# Altium project US-Plus-CPM.PrjPcb (part 1 of 2)
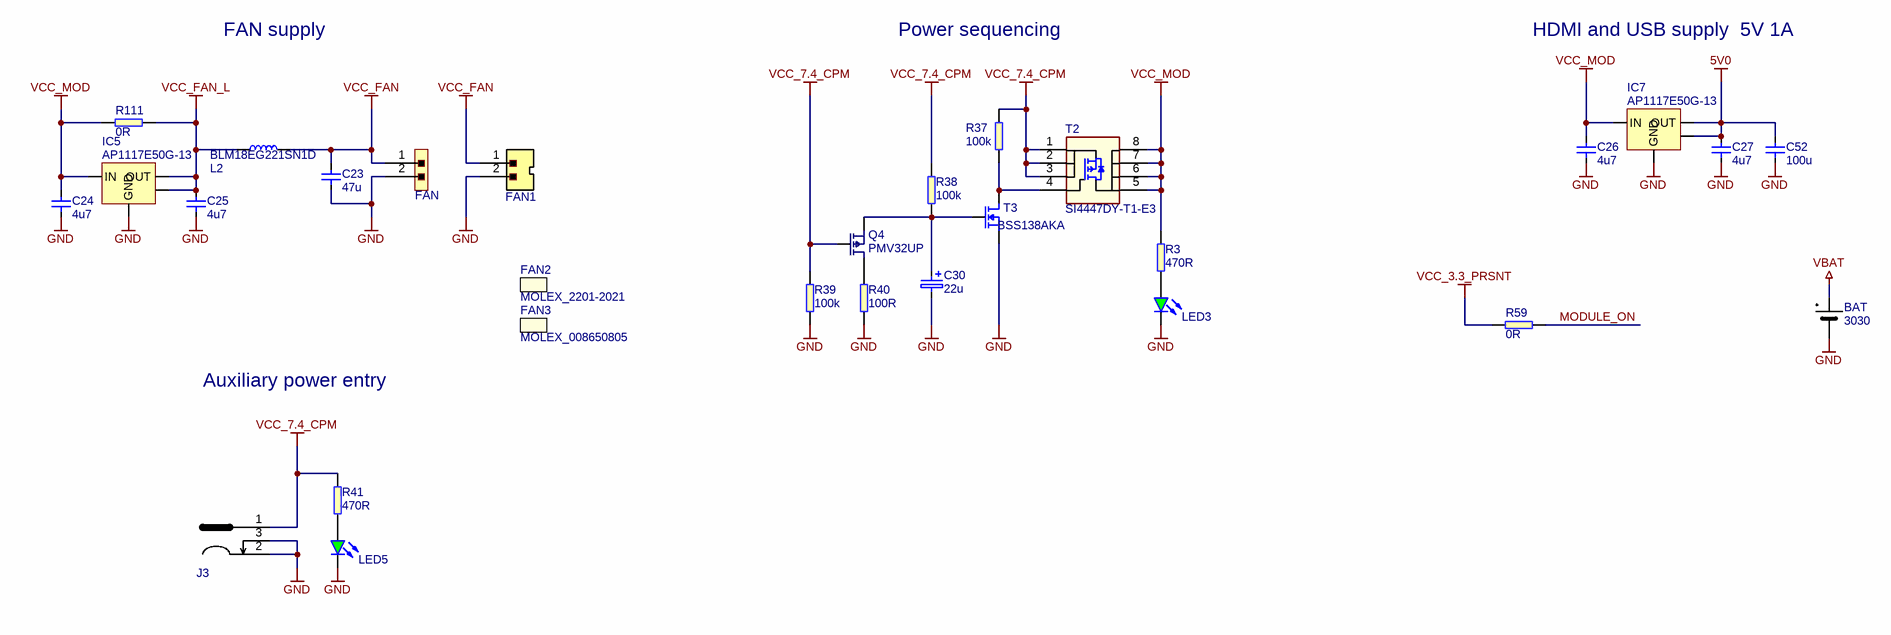
[diagram p0: Supplies.SchDoc]
AM_Title: Ultrascale Plus CPM; AM_Status: OSHW; AM_Revision: 3.3.1
9 sheets, 279 parts. Net scope: global (net labels, ports and power ports of the same name join across sheets).
Board file: PCB.PcbDoc
Sheets:
  Supplies.SchDoc
  SoM-Connectors.SchDoc
  Backplane-Connector.SchDoc
  SoM-MGTH.SchDoc
  Sensor-Connector.SchDoc
  Display-Port.SchDoc
  Debug.SchDoc
  Interfaces.SchDoc
  HDMI.SchDoc

## Sheet Supplies.SchDoc
size A3; DocumentNumber: 1; SheetNumber: 1; SheetTotal: 9; PageSetup: Record=PageOptions|CenterHorizontal=True|CenterVertical=True|PrintScale=0.97|XCorrection=1.00|YCorrection=1.00|PrintKind=1|BorderSize=5000000|LeftOffset=0|BottomOffset=0|Orientation=2|PaperLength=2970|PaperWidth=2100|Scale=100|PaperSource=7|PrintQuality=600|MediaType=1|DitherType=10|PaperKind=A4|PrintScaleMode=1

### Parts
BAT  3030  [KEYSTONE_CR1025]
C23  47u  [1206]
C24  4u7  [0603]
C25  4u7  [0603]
C26  4u7  [0603]
C27  4u7  [0603]
C30  value 22u  [KEMET_C]
C52  100u  [0805]
FAN  *  [HEADER_1X2_male 2.54mm Angle]  (value not drawn)
FAN1  MX-22-23-2021  [molex_2223-2021]  (value not drawn)
FAN2  MOLEX_2201-2021  (no BOM)
FAN3  MOLEX_008650805  (no BOM)
IC5  AP1117E50G-13  [SOT223]
IC7  AP1117E50G-13  [SOT223]
J3  694106106102  [694106106102]  (value not drawn)
L2  BLM18EG221SN1D  [0603]
LED3  KPT-1608SGC  [LED0603]  (value not drawn)
LED5  KPT-1608SGC  [LED0603]  (value not drawn)
Q4  PMV32UP  [SOT-23]
R3  470R  [0603]
R37  100k  [0603]
R38  100k  [0603]
R39  100k  [0603]
R40  100R  [0603]
R41  470R  [0603]
R59  0R  [0603]
R111  0R  [0603]
T2  SI4447DY-T1-E3  [SOIC-SN8_M]
T3  BSS138AKA  [SOT-23]

### Nets
5V0: C27.2 C52.2 IC7.2(OUT) IC7.4(OUT)
GND: BAT.- C23.1 C24.1 C25.1 C26.1 C27.1 C30.2 C52.1 FAN.2 FAN1.2 IC5.1(GND) IC7.1(GND) J3.2 J3.3 LED3.K LED5.K R39.1 R40.1 T3.2(S)
VBAT: BAT.+
VCC_3.3_PRSNT: R59.1
VCC_7.4_CPM: J3.1 Q4.1(G) R37.2 R38.2 R39.2 R41.2 T2.1 T2.2 T2.3
VCC_FAN: C23.2 FAN.1 FAN1.1 L2.2
VCC_FAN_L: C25.2 IC5.2(OUT) IC5.4(OUT) L2.1 R111.2
VCC_MOD: C24.2 C26.2 IC5.3(IN) IC7.3(IN) R3.2 R111.1 T2.5 T2.6 T2.7 T2.8
MODULE_ON: R59.2
NetC30_1: C30.1 Q4.2(S) R38.1 T3.1(G)
NetLED3_A: LED3.A R3.1
NetLED5_A: LED5.A R41.1
NetQ4_3: Q4.3(D) R40.2
NetR37_1: R37.1 T2.4 T3.3(D)

### Notes on the sheet
- FAN supply
- Power sequencing
- HDMI and USB supply  5V 1A
- Auxiliary power entry
- Title:
- Size:
- Date:
- A3
- Revision:
- Page:
- of
- Antmicro Ltd.
- File:
- www.antmicro.com

### Library data of the parts
BAT = Keystone_CR1025: SMT holder for  CR1025 battery; Value: 3030; Manufacturer: Keystone; Part Number: Keystone_CR1025; MPN: 3030
C23 = C_47u_1206: MLCC SMT Capacitor 47uF 1206; Manufacturer: MURATA; MPN: GRM31CC80J476KE18L; Value: 47u; Part Number: C_47u_1206
C24-C27 = C_4u7_0603: MLCC SMT Capacitor 4u7F 0603; Manufacturer: MULTICOMP; MPN: MC0603X475K6R3CT; Value: 4u7; Part Number: C_4u7_0603
C30 = C_22u_KEMET_C: Tantalum SMT Capacitor 22uF Case KEMET_C; Manufacturer: KEMET; MPN: T491C226K025AT; Part Number: C_22u_KEMET_C
C52 = C_100u_0805: MLCC SMT Capacitor 100uF 0805; Manufacturer: MURATA; MPN: GRM21BR60J107ME15L; Part Number: C_100u_0805; Value: 100u
FAN = HEADER_1X2_male_angle: 1x2 pinhead male angle; Part Number: HEADER_1X2_male_angle
FAN1 = molex_2223-2021: Pinhead connector with key; Manufacturer: Molex; MPN: 022232021 A-6373-02A222; Part Number: molex_2223-2021; Value: MX-22-23-2021
FAN2 = MOLEX_2201-2021: KK 254 Crimp Housing 2 circuits; Manufacturer: MOLEX; Part Number: MOLEX_2201-2021; Value: MOLEX_2201-2021; MPN: MOLEX_2201-2021
FAN3 = MOLEX_008650805: conn term female 22-30 awg tin; Manufacturer: MOLEX; Part Number: MOLEX_008650805; Value: MOLEX_008650805; MPN: MOLEX_008650805
IC5 IC7 = AP1117E50G-13: LDO, 2V/5.5V, 1A, 5V,  SOT223; Manufacturer: Diodes; Value: AP1117E50G-13; Part Number: AP1117E50G-13; MPN: AP1117E50G-13
J3 = WE-694106106102: DC Power Jack Right Angled SMT Ø6.4 with 4 soldering pads & pegs WR-DC; Manufacturer: WURTH ELEKTRONIK; Part Number: WE-694106106102; Value: 694106106102; MPN: 694106106102
L2 = BLM18EG221SN1D: MURATA 	BLM18EG221SN1D  FERRITE BEAD, 0.05OHM, 2A, 0603; Part Number: BLM18EG221SN1D; Value: BLM18EG221SN1D; Manufacturer: MURATA; MPN: BLM18EG221SN1D
LED3 LED5 = LED_G: LED Green 0603 case; Part Number: LED_G; Manufacturer: KINGBRIGHT; Value: KPT-1608SGC; MPN: KPT-1608SGC
Q4 = PMV32UP: P CH, 20V, 4A; Manufacturer: NXP; Part Number: PMV32UP; Value: PMV32UP; MPN: PMV32UP
R3 R41 = R_470R_0603: SMT Resistor 470R 0603; Manufacturer: BOURNS; MPN: CR0603-JW-471GLF; Value: 470R; Part Number: R_470R_0603
R37-R39 = R_100k_0603: SMT Resistor 100k 0603; Manufacturer: BOURNS; MPN: CR0603-JW-104GLF; Value: 100k; Part Number: R_100k_0603
R40 = R_100R_0603: SMT Resistor 100R 0603; Manufacturer: MULTICOMP; MPN: MC0063W06035100R; Value: 100R; Part Number: R_100R_0603
R59 R111 = R_0R_0603: SMT Resistor 0R 0603; Manufacturer: BOURNS; MPN: CR0603-J/-000ELF; Value: 0R; Part Number: R_0R_0603
T2 = SI4447DY-T1-E3: p-channel MOSFET, SI4447DY-T1-E3; Manufacturer: VISHAY; Part Number: SI4447DY-T1-E3; Value: SI4447DY-T1-E3; MPN: SI4447DY-T1-E3
T3 = BSS138: MOSFET, N CH, 60V, 0.2A; Part Number: BSS138; Manufacturer: NXP; Value: BSS138AKA; MPN: BSS138AKA

## Sheet SoM-Connectors.SchDoc
size A3; DocumentNumber: 2; SheetNumber: 2; SheetTotal: 9; PageSetup: Record=PageOptions|CenterHorizontal=True|CenterVertical=True|PrintScale=0.97|XCorrection=1.00|YCorrection=1.00|PrintKind=1|BorderSize=5000000|LeftOffset=0|BottomOffset=0|Orientation=2|PaperLength=2970|PaperWidth=2100|Scale=100|PaperSource=7|PrintQuality=600|MediaType=1|DitherType=10|PaperKind=A4|PrintScaleMode=1
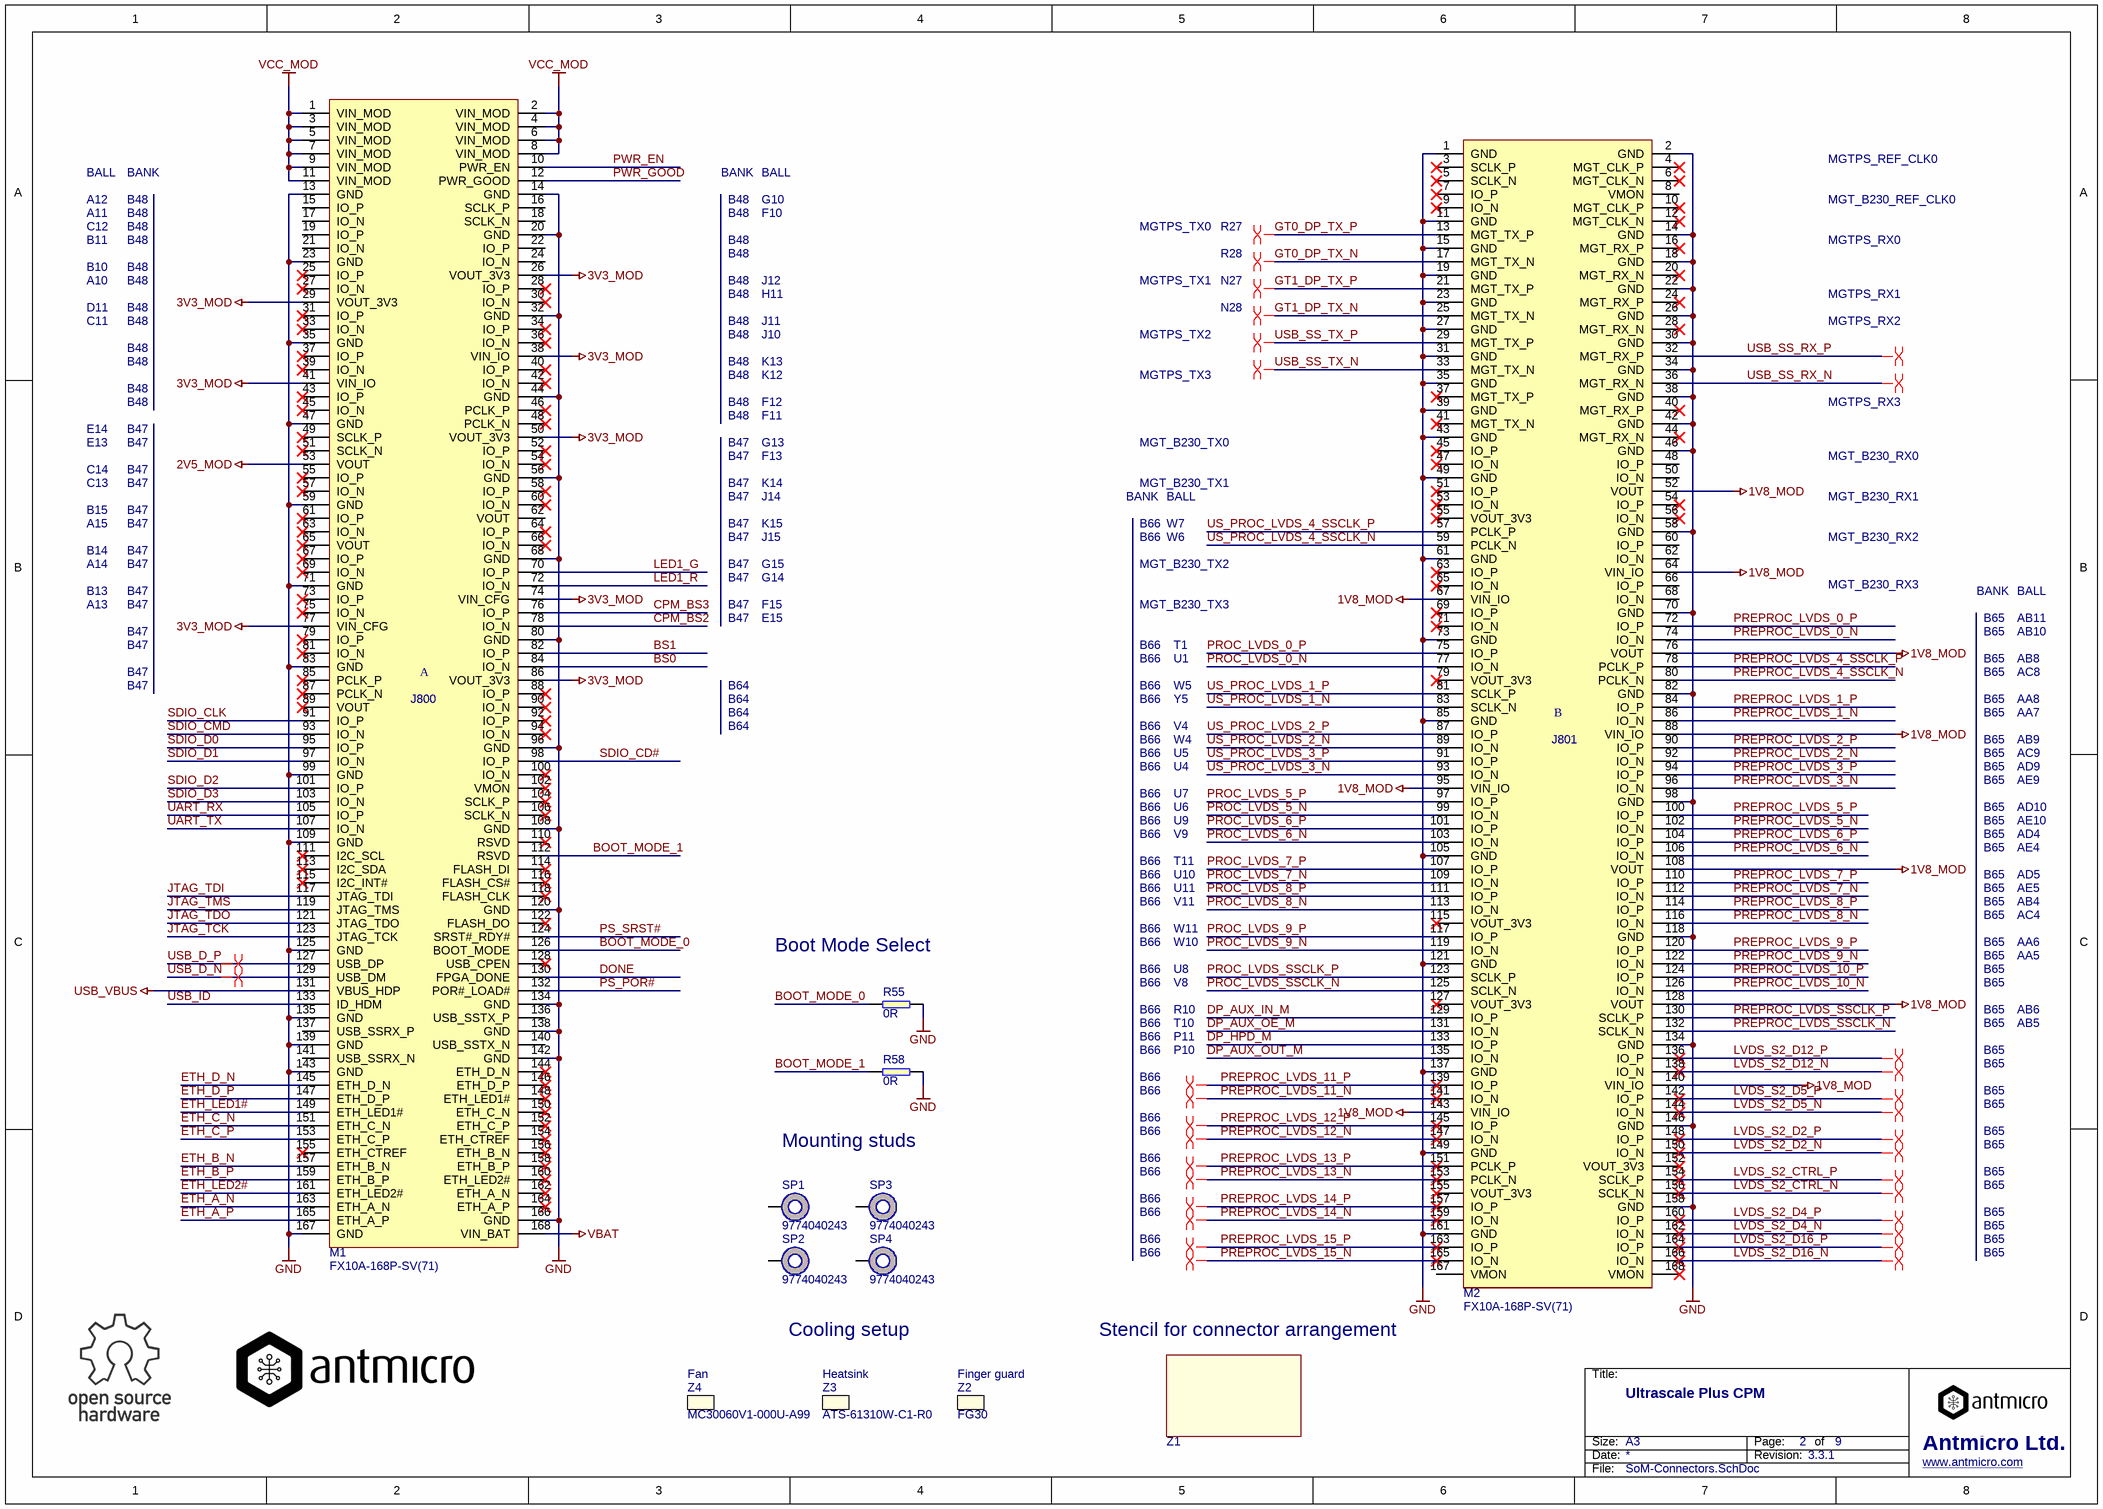
[diagram p1: SoM-Connectors.SchDoc]

### Parts
M1  FX10A-168P-SV(71)  [HIROSE_FX10A-168P-SV(71)]
M2  FX10A-168P-SV(71)  [HIROSE_FX10A-168P-SV(71)]
R55  0R  [0603]
R58  0R  [0603]
SP1  9774040243  [M2-4mm]
SP2  9774040243  [M2-4mm]
SP3  9774040243  [M2-4mm]
SP4  9774040243  [M2-4mm]
Z1  Mechanical  [mercury_74x54_module]  (value not drawn)  (no BOM)
Z2  FG30  (no BOM)
Z3  ATS-61310W-C1-R0  (no BOM)
Z4  MC30060V1-000U-A99  (no BOM)

### Nets
1V8_MOD: M2.52(VOUT) M2.64(VIN_IO) M2.67(VIN_IO) M2.76(VOUT) M2.88(VIN_IO) M2.95(VIN_IO) M2.108(VOUT) M2.128(VOUT) M2.140(VIN_IO) M2.143(VIN_IO)
2V5_MOD: M1.53(VOUT)
3V3_MOD: M1.26(VOUT_3V3) M1.29(VOUT_3V3) M1.38(VIN_IO) M1.41(VIN_IO) M1.50(VOUT_3V3) M1.74(VIN_CFG) M1.77(VIN_CFG) M1.86(VOUT_3V3)
GND: M1.13(GND) M1.14(GND) M1.20(GND) M1.23(GND) M1.32(GND) M1.35(GND) M1.44(GND) M1.47(GND) M1.56(GND) M1.59(GND) M1.68(GND) M1.71(GND) M1.80(GND) M1.83(GND) M1.96(GND) M1.99(GND) M1.108(GND) M1.109(GND) M1.120(GND) M1.125(GND) M1.134(GND) M1.135(GND) M1.138(GND) M1.139(GND) M1.142(GND) M1.143(GND) M1.166(GND) M1.167(GND) M2.1(GND) M2.2(GND) M2.11(GND) M2.14(GND) M2.15(GND) M2.18(GND) M2.19(GND) M2.22(GND) M2.23(GND) M2.26(GND) M2.27(GND) M2.30(GND) M2.31(GND) M2.34(GND) M2.35(GND) M2.38(GND) M2.39(GND) M2.42(GND) M2.43(GND) M2.46(GND) M2.49(GND) M2.58(GND) M2.61(GND) M2.70(GND) M2.73(GND) M2.82(GND) M2.85(GND) M2.98(GND) M2.105(GND) M2.118(GND) M2.121(GND) M2.134(GND) M2.137(GND) M2.146(GND) M2.149(GND) M2.158(GND) M2.161(GND) R55.2 R58.2
USB_VBUS: M1.131(VBUS_HDP)
VBAT: M1.168(VIN_BAT)
VCC_MOD: M1.1(VIN_MOD) M1.2(VIN_MOD) M1.3(VIN_MOD) M1.4(VIN_MOD) M1.5(VIN_MOD) M1.6(VIN_MOD) M1.7(VIN_MOD) M1.8(VIN_MOD) M1.9(VIN_MOD) M1.11(VIN_MOD)
BOOT_MODE_0: M1.126(BOOT_MODE) R55.1
BOOT_MODE_1: M1.112(RSVD) R58.1
BS0: M1.84(IO_N)
BS1: M1.82(IO_P)
CPM_BS2: M1.78(IO_N)
CPM_BS3: M1.76(IO_P)
DONE: M1.130(FPGA_DONE)
DP_AUX_IN_M: M2.129(IO_P)
DP_AUX_OE_M: M2.131(IO_N)
DP_AUX_OUT_M: M2.135(IO_N)
DP_HPD_M: M2.133(IO_P)
ETH_A_N: M1.163(ETH_A_N)
ETH_A_P: M1.165(ETH_A_P)
ETH_B_N: M1.157(ETH_B_N)
ETH_B_P: M1.159(ETH_B_P)
ETH_C_N: M1.151(ETH_C_N)
ETH_C_P: M1.153(ETH_C_P)
ETH_D_N: M1.145(ETH_D_N)
ETH_D_P: M1.147(ETH_D_P)
ETH_LED1#: M1.149(ETH_LED1#)
ETH_LED2#: M1.161(ETH_LED2#)
GT0_DP_TX_N: M2.17(MGT_TX_N)
GT0_DP_TX_P: M2.13(MGT_TX_P)
GT1_DP_TX_N: M2.25(MGT_TX_N)
GT1_DP_TX_P: M2.21(MGT_TX_P)
JTAG_TCK: M1.123(JTAG_TCK)
JTAG_TDI: M1.117(JTAG_TDI)
JTAG_TDO: M1.121(JTAG_TDO)
JTAG_TMS: M1.119(JTAG_TMS)
LED1_G: M1.70(IO_P)
LED1_R: M1.72(IO_N)
LVDS_S2_CTRL_N: M2.156(SCLK_N)
LVDS_S2_CTRL_P: M2.154(SCLK_P)
LVDS_S2_D2_N: M2.150(IO_N)
LVDS_S2_D2_P: M2.148(IO_P)
LVDS_S2_D4_N: M2.162(IO_N)
LVDS_S2_D4_P: M2.160(IO_P)
LVDS_S2_D5_N: M2.144(IO_N)
LVDS_S2_D5_P: M2.142(IO_P)
LVDS_S2_D12_N: M2.138(IO_N)
LVDS_S2_D12_P: M2.136(IO_P)
LVDS_S2_D16_N: M2.166(IO_N)
LVDS_S2_D16_P: M2.164(IO_P)
PREPROC_LVDS_0_N: M2.74(IO_N)
PREPROC_LVDS_0_P: M2.72(IO_P)
PREPROC_LVDS_1_N: M2.86(IO_N)
PREPROC_LVDS_1_P: M2.84(IO_P)
PREPROC_LVDS_2_N: M2.92(IO_N)
PREPROC_LVDS_2_P: M2.90(IO_P)
PREPROC_LVDS_3_N: M2.96(IO_N)
PREPROC_LVDS_3_P: M2.94(IO_P)
PREPROC_LVDS_4_SSCLK_N: M2.80(PCLK_N)
PREPROC_LVDS_4_SSCLK_P: M2.78(PCLK_P)
PREPROC_LVDS_5_N: M2.102(IO_N)
PREPROC_LVDS_5_P: M2.100(IO_P)
PREPROC_LVDS_6_N: M2.106(IO_N)
PREPROC_LVDS_6_P: M2.104(IO_P)
PREPROC_LVDS_7_N: M2.112(IO_N)
PREPROC_LVDS_7_P: M2.110(IO_P)
PREPROC_LVDS_8_N: M2.116(IO_N)
PREPROC_LVDS_8_P: M2.114(IO_P)
PREPROC_LVDS_9_N: M2.122(IO_N)
PREPROC_LVDS_9_P: M2.120(IO_P)
PREPROC_LVDS_10_N: M2.126(IO_N)
PREPROC_LVDS_10_P: M2.124(IO_P)
PREPROC_LVDS_11_N: M2.141(IO_N)
PREPROC_LVDS_11_P: M2.139(IO_P)
PREPROC_LVDS_12_N: M2.147(IO_N)
PREPROC_LVDS_12_P: M2.145(IO_P)
PREPROC_LVDS_13_N: M2.153(PCLK_N)
PREPROC_LVDS_13_P: M2.151(PCLK_P)
PREPROC_LVDS_14_N: M2.159(IO_N)
PREPROC_LVDS_14_P: M2.157(IO_P)
PREPROC_LVDS_15_N: M2.165(IO_N)
PREPROC_LVDS_15_P: M2.163(IO_P)
PREPROC_LVDS_SSCLK_N: M2.132(SCLK_N)
PREPROC_LVDS_SSCLK_P: M2.130(SCLK_P)
PROC_LVDS_0_N: M2.77(IO_N)
PROC_LVDS_0_P: M2.75(IO_P)
PROC_LVDS_5_N: M2.99(IO_N)
PROC_LVDS_5_P: M2.97(IO_P)
PROC_LVDS_6_N: M2.103(IO_N)
PROC_LVDS_6_P: M2.101(IO_P)
PROC_LVDS_7_N: M2.109(IO_N)
PROC_LVDS_7_P: M2.107(IO_P)
PROC_LVDS_8_N: M2.113(IO_N)
PROC_LVDS_8_P: M2.111(IO_P)
PROC_LVDS_9_N: M2.119(IO_N)
PROC_LVDS_9_P: M2.117(IO_P)
PROC_LVDS_SSCLK_N: M2.125(SCLK_N)
PROC_LVDS_SSCLK_P: M2.123(SCLK_P)
PS_POR#: M1.132(POR#_LOAD#)
PS_SRST#: M1.124(SRST#_RDY#)
PWR_EN: M1.10(PWR_EN)
PWR_GOOD: M1.12(PWR_GOOD)
SDIO_CD#: M1.98(IO_P)
SDIO_CLK: M1.91(IO_P)
SDIO_CMD: M1.93(IO_N)
SDIO_D0: M1.95(IO_P)
SDIO_D1: M1.97(IO_N)
SDIO_D2: M1.101(IO_P)
SDIO_D3: M1.103(IO_N)
UART_RX: M1.105(IO_P)
UART_TX: M1.107(IO_N)
US_PROC_LVDS_1_N: M2.83(SCLK_N)
US_PROC_LVDS_1_P: M2.81(SCLK_P)
US_PROC_LVDS_2_N: M2.89(IO_N)
US_PROC_LVDS_2_P: M2.87(IO_P)
US_PROC_LVDS_3_N: M2.93(IO_N)
US_PROC_LVDS_3_P: M2.91(IO_P)
US_PROC_LVDS_4_SSCLK_N: M2.59(PCLK_N)
US_PROC_LVDS_4_SSCLK_P: M2.57(PCLK_P)
USB_D_N: M1.129(USB_DM)
USB_D_P: M1.127(USB_DP)
USB_ID: M1.133(ID_HDM)
USB_SS_RX_N: M2.36(MGT_RX_N)
USB_SS_RX_P: M2.32(MGT_RX_P)
USB_SS_TX_N: M2.33(MGT_TX_N)
USB_SS_TX_P: M2.29(MGT_TX_P)

Not connected (* = marked no-connect by the designer): M1 15(IO_P) 16(SCLK_P) 17(IO_N) 18(SCLK_N) 19(IO_P) 21(IO_N) 22(IO_P) 24(IO_N) 25(IO_P)* 27(IO_N)* 28(IO_P)* 30(IO_N)* 31(IO_P)* 33(IO_N)* 34(IO_P)* 36(IO_N)* 37(IO_P)* 39(IO_N)* 40(IO_P)* 42(IO_N)* 43(IO_P)* 45(IO_N)* 46(PCLK_P)* 48(PCLK_N)* 49(SCLK_P)* 51(SCLK_N)* 52(IO_P)* 54(IO_N)* 55(IO_P)* 57(IO_N)* 58(IO_P)* 60(IO_N)* 61(IO_P)* 62(VOUT) 63(IO_N)* 64(IO_P)* 65(VOUT)* 66(IO_N)* 67(IO_P)* 69(IO_N)* 73(IO_P)* 75(IO_N)* 79(IO_P)* 81(IO_N)* 85(PCLK_P)* 87(PCLK_N)* 88(IO_P)* 89(VOUT)* 90(IO_N)* 92(IO_P)* 94(IO_N)* 100(IO_N)* 102(VMON)* 104(SCLK_P)* 106(SCLK_N)* 110(RSVD)* 111(I2C_SCL)* 113(I2C_SDA)* 114(FLASH_DI)* 115(I2C_INT#)* 116(FLASH_CS#)* 118(FLASH_CLK)* 122(FLASH_DO)* 128(USB_CPEN)* 136(USB_SSTX_P) 137(USB_SSRX_P) 140(USB_SSTX_N) 141(USB_SSRX_N) 144(ETH_D_N)* 146(ETH_D_P)* 148(ETH_LED1#)* 150(ETH_C_N)* 152(ETH_C_P)* 154(ETH_CTREF)* 155(ETH_CTREF)* 156(ETH_B_N)* 158(ETH_B_P)* 160(ETH_LED2#)* 162(ETH_A_N)* 164(ETH_A_P)*; M2 3(SCLK_P)* 4(MGT_CLK_P)* 5(SCLK_N)* 6(MGT_CLK_N)* 7(IO_P)* 8(VMON) 9(IO_N)* 10(MGT_CLK_P)* 12(MGT_CLK_N)* 16(MGT_RX_P)* 20(MGT_RX_N)* 24(MGT_RX_P)* 28(MGT_RX_N)* 37(MGT_TX_P)* 40(MGT_RX_P)* 41(MGT_TX_N)* 44(MGT_RX_N)* 45(IO_P)* 47(IO_N)* 48(IO_P) 50(IO_N) 51(IO_P)* 53(IO_N)* 54(IO_P)* 55(VOUT_3V3)* 56(IO_N)* 60(IO_P) 62(IO_N) 63(IO_P)* 65(IO_N)* 66(IO_P) 68(IO_N) 69(IO_P)* 71(IO_N)* 79(VOUT_3V3)* 115(VOUT_3V3)* 127(VOUT_3V3)* 152(VOUT_3V3)* 155(VOUT_3V3)* 167(VMON) 168(VMON)*; SP1 1; SP2 1; SP3 1; SP4 1

### Layout directives
differential pair: GT0_DP_TX_N, GT0_DP_TX_P, GT1_DP_TX_N, GT1_DP_TX_P, LVDS_S2_CTRL_N, LVDS_S2_CTRL_P, LVDS_S2_D2_N, LVDS_S2_D2_P, LVDS_S2_D4_N, LVDS_S2_D4_P, LVDS_S2_D5_N, LVDS_S2_D5_P, LVDS_S2_D12_N, LVDS_S2_D12_P, LVDS_S2_D16_N, LVDS_S2_D16_P, PREPROC_LVDS_11_N, PREPROC_LVDS_11_P, PREPROC_LVDS_12_N, PREPROC_LVDS_12_P, PREPROC_LVDS_13_N, PREPROC_LVDS_13_P, PREPROC_LVDS_14_N, PREPROC_LVDS_14_P, PREPROC_LVDS_15_N, PREPROC_LVDS_15_P, USB_D_N, USB_D_P, USB_SS_RX_N, USB_SS_RX_P, USB_SS_TX_N, USB_SS_TX_P

### Notes on the sheet
- BALL
- BANK
- MGTPS_REF_CLK0
- A12
- A11
- C12
- B11
- B48
- G10
- F10
- MGTPS_TX0
- R27
- MGT_B230_REF_CLK0
- MGTPS_RX0
- B10
- A10
- D11
- J12
- H11
- MGTPS_TX1
- R28
- N27
- N28
- MGTPS_RX1
- C11
- J11
- J10
- K13
- K12
- MGTPS_TX2
- MGTPS_TX3
- MGTPS_RX2
- E14
- E13
- B47
- F12
- F11
- G13
- MGT_B230_TX0
- MGTPS_RX3
- C14
- C13
- B15
- F13
- K14
- J14
- MGT_B230_TX1
- MGT_B230_RX0
- MGT_B230_RX1
- A15
- B14
- A14
- K15
- J15
- G15
- G14
- B66
- MGT_B230_TX2
- W7
- W6
- MGT_B230_RX2
- MGT_B230_RX3
- B13
- A13
- F15
- E15
- MGT_B230_TX3
- T1
- B65
- AB11
- AB10
- (near M1) J800
- B64
- U1
- W5
- Y5
- AB8
- AC8
- AA8
- AA7
- V4
- W4
- U5
- U4
- (near M2) J801
- AB9
- AC9
- AD9
- AE9
- U7
- U6
- U9
- V9
- AD10
- AE10
- AD4
- AE4
- T11
- U10
- U11
- V11
- AD5
- AE5
- AB4
- AC4
- (near R55) Boot Mode Select
- W11
- W10
- U8
- V8
- AA6
- AA5
- R10
- T10
- P11
- P10
- AB6
- AB5
- Mounting studs
- (near Z4) Fan
- Cooling setup
- (near Z3) Heatsink
- (near Z2) Finger guard
- Stencil for connector arrangement
- Title:
- Size:
- Date:
- A3
- Revision:
- Page:
- of
- Antmicro Ltd.
- File:
- www.antmicro.com
- (in symbol Mercury_US1_A) A
- (in symbol Mercury_US1_B) B

### Library data of the parts
M1 = Mercury_US1_A: Enclustra Mercury Ultrascale connector; Manufacturer: Hirose; Part Number: Mercury_US1_A; Value: FX10A-168P-SV(71); MPN: FX10A-168P-SV(71)
M2 = Mercury_US1_B: Enclustra Mercury Ultrascale connector; Manufacturer: Hirose; Part Number: Mercury_US1_B; Value: FX10A-168P-SV(71); MPN: FX10A-168P-SV(71)
R55 R58 = R_0R_0603: as R59 on sheet Supplies; Value: 0R; Part Number: R_0R_0603
SP1-SP4 = WE_9774040243: M2x4; Manufacturer: WURTH ELEKTRONIK; MPN: 9774040243R; Part Number: WE_9774040243; Value: 9774040243
Z1 = MercuryModule_74x54: Part Number: MercuryModule_74x54
Z2 = FG30: Fan Finger Guard, Grille, 30mm 30mm 24mm, steel; Manufacturer: SEPA; Part Number: FG30; Value: FG30; MPN: FG30
Z3 = ATS-61310W-C1-R0: Heat Sinks FANSINK ASSY 30.25 X 30.25 X 24.5 (MM); Manufacturer: Advanced Thermal Solution; Part Number: ATS-61310W-C1-R0; Value: ATS-61310W-C1-R0; MPN: ATS-61310W-C1-R0
Z4 = MC30060V1-000U-A99: Fan: DC; axial; 5VDC; 30x30x6mm; 8.32m3/h; 28dBA; Vapo; 3.55mmH2O; Manufacturer: SUNON; Part Number: MC30060V1-000U-A99; Value: MC30060V1-000U-A99; MPN: MC30060V1-000U-A99

## Sheet Backplane-Connector.SchDoc
size A3; DocumentNumber: 3; SheetNumber: 3; SheetTotal: 9; PageSetup: Record=PageOptions|CenterHorizontal=True|CenterVertical=True|PrintScale=0.97|XCorrection=1.00|YCorrection=1.00|PrintKind=1|BorderSize=5000000|LeftOffset=0|BottomOffset=0|Orientation=2|PaperLength=2970|PaperWidth=2100|Scale=100|PaperSource=7|PrintQuality=600|MediaType=1|DitherType=10|PaperKind=A4|PrintScaleMode=1
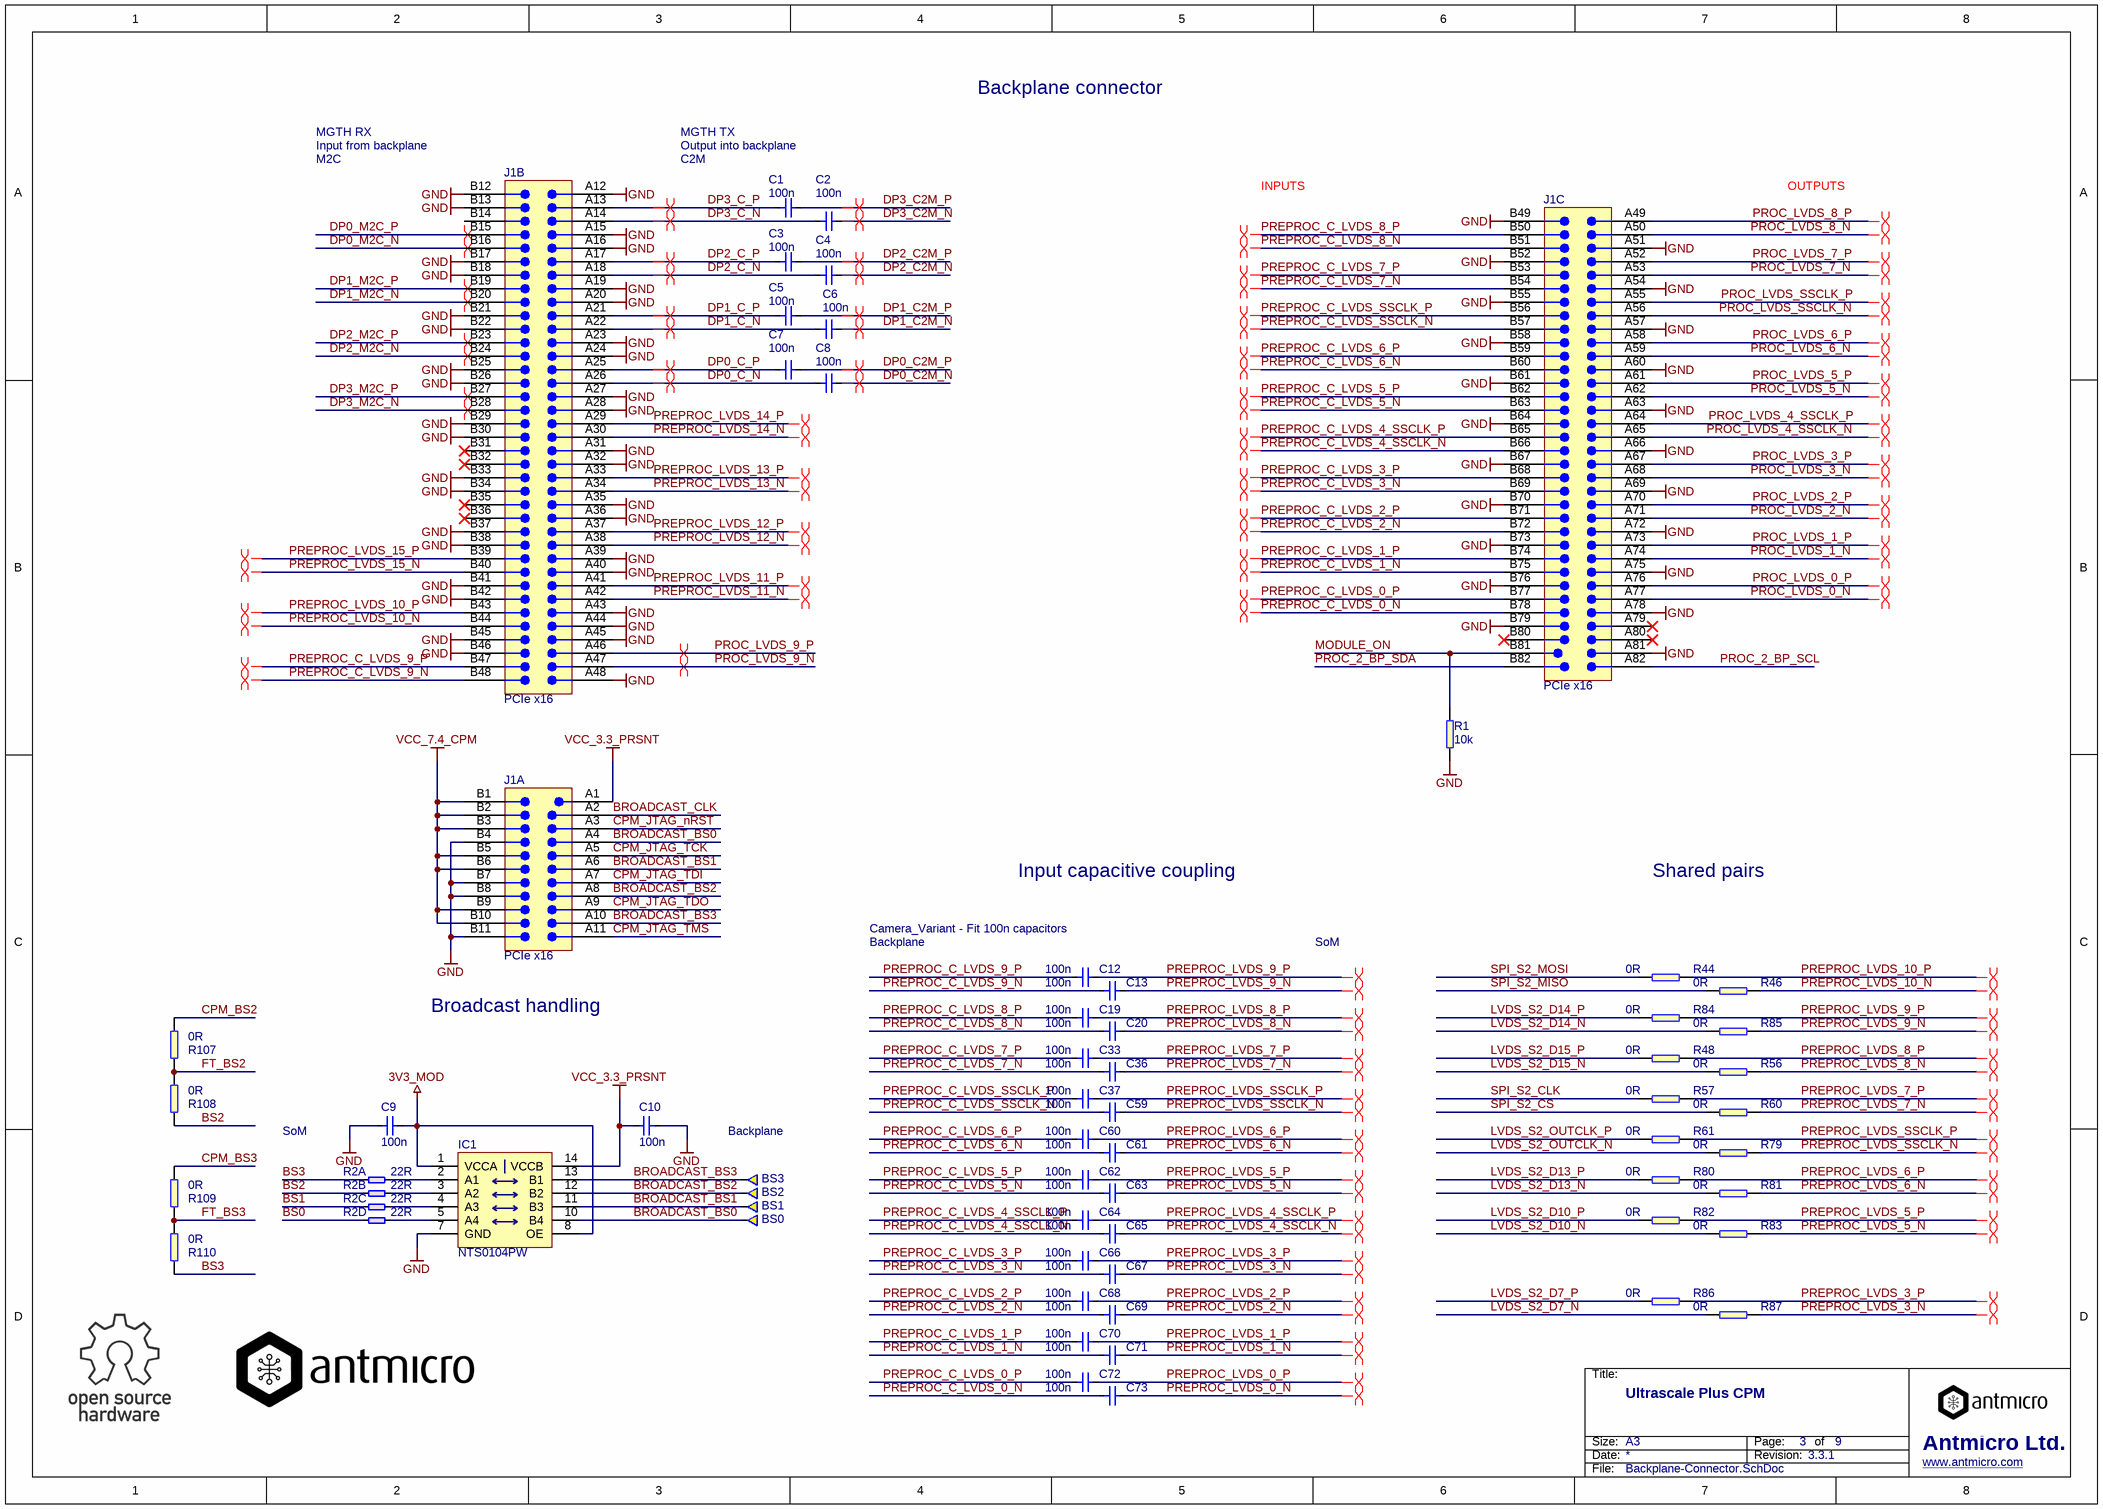
[diagram p2: Backplane-Connector.SchDoc]

### Parts
BS0  *  [Testpad]  (value not drawn)  (no BOM)
BS1  *  [Testpad]  (value not drawn)  (no BOM)
BS2  *  [Testpad]  (value not drawn)  (no BOM)
BS3  *  [Testpad]  (value not drawn)  (no BOM)
C1  100n  [0402]
C2  100n  [0402]
C3  100n  [0402]
C4  100n  [0402]
C5  100n  [0402]
C6  100n  [0402]
C7  100n  [0402]
C8  100n  [0402]
C9  100n  [0402]
C10  100n  [0402]
C12  100n  [0402]
C13  100n  [0402]
C19  100n  [0402]
C20  100n  [0402]
C33  100n  [0402]
C36  100n  [0402]
C37  100n  [0402]
C59  100n  [0402]
C60  100n  [0402]
C61  100n  [0402]
C62  100n  [0402]
C63  100n  [0402]
C64  100n  [0402]
C65  100n  [0402]
C66  100n  [0402]
C67  100n  [0402]
C68  100n  [0402]
C69  100n  [0402]
C70  100n  [0402]
C71  100n  [0402]
C72  100n  [0402]
C73  100n  [0402]
IC1  NTS0104PW  [TSSOP-14]
J1  PCIe x16  [PCIe_x16_card_edge]  (parts A,B,C of 3)  (no BOM)
R1  10k  [0603]
R2  22R  [BOURNS-CAY16-J4]  (parts A,B,C,D of 4)
R44  0R  [0402]
R46  0R  [0402]
R48  0R  [0402]
R56  0R  [0402]
R57  0R  [0402]
R60  0R  [0402]
R61  0R  [0402]
R79  0R  [0402]
R80  0R  [0402]
R81  0R  [0402]
R82  0R  [0402]
R83  0R  [0402]
R84  0R  [0402]
R85  0R  [0402]
R86  0R  [0402]
R87  0R  [0402]
R107  0R  [0402]
R108  0R  [0402]
R109  0R  [0402]
R110  0R  [0402]

### Nets
3V3_MOD: C9.2 IC1.1(VCCA) IC1.8(OE)
GND: C9.1 C10.1 IC1.7(GND) J1.A12 J1.A15 J1.A16 J1.A19 J1.A20 J1.A23 J1.A24 J1.A27 J1.A28 J1.A31 J1.A32 J1.A35 J1.A36 J1.A39 J1.A40 J1.A43 J1.A44 J1.A45 J1.A48 J1.A51 J1.A54 J1.A57 J1.A60 J1.A63 J1.A66 J1.A69 J1.A72 J1.A75 J1.A78 J1.A81 J1.B4 J1.B7 J1.B8 J1.B11 J1.B12 J1.B13 J1.B17 J1.B18 J1.B21 J1.B22 J1.B25 J1.B26 J1.B29 J1.B30 J1.B33 J1.B34 J1.B37 J1.B38 J1.B41 J1.B42 J1.B45 J1.B46 J1.B49 J1.B52 J1.B55 J1.B58 J1.B61 J1.B64 J1.B67 J1.B70 J1.B73 J1.B76 J1.B79 R1.1
VCC_3.3_PRSNT: C10.2 IC1.14(VCCB) J1.A1
VCC_7.4_CPM: J1.B1 J1.B2 J1.B3 J1.B5 J1.B6 J1.B9 J1.B10
BROADCAST_BS0: BS0.1 IC1.10(B4) J1.A4
BROADCAST_BS1: BS1.1 IC1.11(B3) J1.A6
BROADCAST_BS2: BS2.1 IC1.12(B2) J1.A8
BROADCAST_BS3: BS3.1 IC1.13(B1) J1.A10
BROADCAST_CLK: J1.A2
BS0: R2.7
BS1: R2.5
BS2: R2.3 R108.1
BS3: R2.1 R110.1
CPM_BS2: R107.2
CPM_BS3: R109.2
CPM_JTAG_nRST: J1.A3
CPM_JTAG_TCK: J1.A5
CPM_JTAG_TDI: J1.A7
CPM_JTAG_TDO: J1.A9
CPM_JTAG_TMS: J1.A11
DP0_C2M_N: C8.2
DP0_C2M_P: C7.2
DP0_C_N: C8.1 J1.A26
DP0_C_P: C7.1 J1.A25
DP0_M2C_N: J1.B16
DP0_M2C_P: J1.B15
DP1_C2M_N: C6.2
DP1_C2M_P: C5.2
DP1_C_N: C6.1 J1.A22
DP1_C_P: C5.1 J1.A21
DP1_M2C_N: J1.B20
DP1_M2C_P: J1.B19
DP2_C2M_N: C4.2
DP2_C2M_P: C3.2
DP2_C_N: C4.1 J1.A18
DP2_C_P: C3.1 J1.A17
DP2_M2C_N: J1.B24
DP2_M2C_P: J1.B23
DP3_C2M_N: C2.2
DP3_C2M_P: C1.2
DP3_C_N: C2.1 J1.A14
DP3_C_P: C1.1 J1.A13
DP3_M2C_N: J1.B28
DP3_M2C_P: J1.B27
FT_BS2: R107.1 R108.2
FT_BS3: R109.1 R110.2
LVDS_S2_D7_N: R87.1
LVDS_S2_D7_P: R86.1
LVDS_S2_D10_N: R83.1
LVDS_S2_D10_P: R82.1
LVDS_S2_D13_N: R81.1
LVDS_S2_D13_P: R80.1
LVDS_S2_D14_N: R85.1
LVDS_S2_D14_P: R84.1
LVDS_S2_D15_N: R56.1
LVDS_S2_D15_P: R48.1
LVDS_S2_OUTCLK_N: R79.1
LVDS_S2_OUTCLK_P: R61.1
MODULE_ON: J1.B81 R1.2
PREPROC_C_LVDS_0_N: C73.1 J1.B78
PREPROC_C_LVDS_0_P: C72.1 J1.B77
PREPROC_C_LVDS_1_N: C71.1 J1.B75
PREPROC_C_LVDS_1_P: C70.1 J1.B74
PREPROC_C_LVDS_2_N: C69.1 J1.B72
PREPROC_C_LVDS_2_P: C68.1 J1.B71
PREPROC_C_LVDS_3_N: C67.1 J1.B69
PREPROC_C_LVDS_3_P: C66.1 J1.B68
PREPROC_C_LVDS_4_SSCLK_N: C65.1 J1.B66
PREPROC_C_LVDS_4_SSCLK_P: C64.1 J1.B65
PREPROC_C_LVDS_5_N: C63.1 J1.B63
PREPROC_C_LVDS_5_P: C62.1 J1.B62
PREPROC_C_LVDS_6_N: C61.1 J1.B60
PREPROC_C_LVDS_6_P: C60.1 J1.B59
PREPROC_C_LVDS_7_N: C36.1 J1.B54
PREPROC_C_LVDS_7_P: C33.1 J1.B53
PREPROC_C_LVDS_8_N: C20.1 J1.B51
PREPROC_C_LVDS_8_P: C19.1 J1.B50
PREPROC_C_LVDS_9_N: C13.1 J1.B48
PREPROC_C_LVDS_9_P: C12.1 J1.B47
PREPROC_C_LVDS_SSCLK_N: C59.1 J1.B57
PREPROC_C_LVDS_SSCLK_P: C37.1 J1.B56
PREPROC_LVDS_0_N: C73.2
PREPROC_LVDS_0_P: C72.2
PREPROC_LVDS_1_N: C71.2
PREPROC_LVDS_1_P: C70.2
PREPROC_LVDS_2_N: C69.2
PREPROC_LVDS_2_P: C68.2
PREPROC_LVDS_3_N: C67.2 R87.2
PREPROC_LVDS_3_P: C66.2 R86.2
PREPROC_LVDS_4_SSCLK_N: C65.2
PREPROC_LVDS_4_SSCLK_P: C64.2
PREPROC_LVDS_5_N: C63.2 R83.2
PREPROC_LVDS_5_P: C62.2 R82.2
PREPROC_LVDS_6_N: C61.2 R81.2
PREPROC_LVDS_6_P: C60.2 R80.2
PREPROC_LVDS_7_N: C36.2 R60.2
PREPROC_LVDS_7_P: C33.2 R57.2
PREPROC_LVDS_8_N: C20.2 R56.2
PREPROC_LVDS_8_P: C19.2 R48.2
PREPROC_LVDS_9_N: C13.2 R85.2
PREPROC_LVDS_9_P: C12.2 R84.2
PREPROC_LVDS_10_N: J1.B44 R46.2
PREPROC_LVDS_10_P: J1.B43 R44.2
PREPROC_LVDS_11_N: J1.A42
PREPROC_LVDS_11_P: J1.A41
PREPROC_LVDS_12_N: J1.A38
PREPROC_LVDS_12_P: J1.A37
PREPROC_LVDS_13_N: J1.A34
PREPROC_LVDS_13_P: J1.A33
PREPROC_LVDS_14_N: J1.A30
PREPROC_LVDS_14_P: J1.A29
PREPROC_LVDS_15_N: J1.B40
PREPROC_LVDS_15_P: J1.B39
PREPROC_LVDS_SSCLK_N: C59.2 R79.2
PREPROC_LVDS_SSCLK_P: C37.2 R61.2
PROC_2_BP_SCL: J1.A82
PROC_2_BP_SDA: J1.B82
PROC_LVDS_0_N: J1.A77
PROC_LVDS_0_P: J1.A76
PROC_LVDS_1_N: J1.A74
PROC_LVDS_1_P: J1.A73
PROC_LVDS_2_N: J1.A71
PROC_LVDS_2_P: J1.A70
PROC_LVDS_3_N: J1.A68
PROC_LVDS_3_P: J1.A67
PROC_LVDS_4_SSCLK_N: J1.A65
PROC_LVDS_4_SSCLK_P: J1.A64
PROC_LVDS_5_N: J1.A62
PROC_LVDS_5_P: J1.A61
PROC_LVDS_6_N: J1.A59
PROC_LVDS_6_P: J1.A58
PROC_LVDS_7_N: J1.A53
PROC_LVDS_7_P: J1.A52
PROC_LVDS_8_N: J1.A50
PROC_LVDS_8_P: J1.A49
PROC_LVDS_9_N: J1.A47
PROC_LVDS_9_P: J1.A46
PROC_LVDS_SSCLK_N: J1.A56
PROC_LVDS_SSCLK_P: J1.A55
SPI_S2_CLK: R57.1
SPI_S2_CS: R60.1
SPI_S2_MISO: R46.1
SPI_S2_MOSI: R44.1
NetIC1_2: IC1.2(A1) R2.2
NetIC1_3: IC1.3(A2) R2.4
NetIC1_4: IC1.4(A3) R2.6
NetIC1_5: IC1.5(A4) R2.8

Not connected (* = marked no-connect by the designer): J1 A79* A80* B14 B31* B32* B35* B36* B80*

### Layout directives
differential pair; net class PREPROC_MGT: DP0_M2C_N, DP0_M2C_P, DP1_M2C_N, DP1_M2C_P, DP2_M2C_N, DP2_M2C_P, DP3_M2C_N, DP3_M2C_P
differential pair; net class PROC_LVDS: PREPROC_LVDS_10_N, PREPROC_LVDS_10_P, PREPROC_LVDS_11_N, PREPROC_LVDS_11_P, PREPROC_LVDS_12_N, PREPROC_LVDS_12_P, PREPROC_LVDS_13_N, PREPROC_LVDS_13_P, PREPROC_LVDS_14_N, PREPROC_LVDS_14_P, PREPROC_LVDS_15_N, PREPROC_LVDS_15_P, PROC_LVDS_9_N, PROC_LVDS_9_P
differential pair: DP0_C2M_N, DP0_C2M_P, DP0_C_N, DP0_C_P, DP1_C2M_N, DP1_C2M_P, DP1_C_N, DP1_C_P, DP2_C2M_N, DP2_C2M_P, DP2_C_N, DP2_C_P, DP3_C2M_N, DP3_C2M_P, DP3_C_N, DP3_C_P, PREPROC_C_LVDS_0_N, PREPROC_C_LVDS_0_P, PREPROC_C_LVDS_1_N, PREPROC_C_LVDS_1_P, PREPROC_C_LVDS_2_N, PREPROC_C_LVDS_2_P, PREPROC_C_LVDS_3_N, PREPROC_C_LVDS_3_P, PREPROC_C_LVDS_4_SSCLK_N, PREPROC_C_LVDS_4_SSCLK_P, PREPROC_C_LVDS_5_N, PREPROC_C_LVDS_5_P, PREPROC_C_LVDS_6_N, PREPROC_C_LVDS_6_P, PREPROC_C_LVDS_7_N, PREPROC_C_LVDS_7_P, PREPROC_C_LVDS_8_N, PREPROC_C_LVDS_8_P, PREPROC_C_LVDS_9_N, PREPROC_C_LVDS_9_P, PREPROC_C_LVDS_SSCLK_N, PREPROC_C_LVDS_SSCLK_P, PREPROC_LVDS_0_N, PREPROC_LVDS_0_P, PREPROC_LVDS_1_N, PREPROC_LVDS_1_P, PREPROC_LVDS_2_N, PREPROC_LVDS_2_P, PREPROC_LVDS_3_N, PREPROC_LVDS_3_P, PREPROC_LVDS_4_SSCLK_N, PREPROC_LVDS_4_SSCLK_P, PREPROC_LVDS_5_N, PREPROC_LVDS_5_P, PREPROC_LVDS_6_N, PREPROC_LVDS_6_P, PREPROC_LVDS_7_N, PREPROC_LVDS_7_P, PREPROC_LVDS_8_N, PREPROC_LVDS_8_P, PREPROC_LVDS_9_N, PREPROC_LVDS_9_P, PREPROC_LVDS_10_N, PREPROC_LVDS_10_P, PREPROC_LVDS_SSCLK_N, PREPROC_LVDS_SSCLK_P, PROC_LVDS_0_N, PROC_LVDS_0_P, PROC_LVDS_1_N, PROC_LVDS_1_P, PROC_LVDS_2_N, PROC_LVDS_2_P, PROC_LVDS_3_N, PROC_LVDS_3_P, PROC_LVDS_4_SSCLK_N, PROC_LVDS_4_SSCLK_P, PROC_LVDS_5_N, PROC_LVDS_5_P, PROC_LVDS_6_N, PROC_LVDS_6_P, PROC_LVDS_7_N, PROC_LVDS_7_P, PROC_LVDS_8_N, PROC_LVDS_8_P, PROC_LVDS_SSCLK_N, PROC_LVDS_SSCLK_P

### Notes on the sheet
- Backplane connector
- Input from backplane
- MGTH RX
- M2C
- Output into backplane
- MGTH TX
- C2M
- INPUTS
- OUTPUTS
- Input capacitive coupling
- Shared pairs
- Backplane
- Camera_Variant - Fit 100n capacitors
- SoM
- Broadcast handling
- Title:
- Size:
- Date:
- A3
- Revision:
- Page:
- of
- Antmicro Ltd.
- File:
- www.antmicro.com

### Library data of the parts
BS0-BS3 = Testpad: Testpad 2mm diameter; Part Number: Testpad
C1-C10 C12 C13 C19 C20 C33 C36 C37 C59-C73 = C_100n_0402: MLCC SMT Capacitor 100nF 0402; Manufacturer: MULTICOMP; MPN: MC0402X104M100CT; Value: 100n; Part Number: C_100n_0402
IC1 = NTS0104PW: 4 bit voltage level translator; Manufacturer: NXP; Part Number: NTS0104PW; Value: NTS0104PW; MPN: NTS0104PW
J1 = PCIe x16: PCI Express x16 164 2.36 mm; Part Number: 10018783-10113TLF; MPN: generic; Value: generic; Manufacturer: generic
R1 = R_10k_0603: SMT Resistor 10k 0603; Manufacturer: BOURNS; MPN: CR0603-JW-103ELF; Value: 10k; Part Number: R_10k_0603
R2 = CAY16-220J4LF: Bourns, 4 x 22R, CAY16; Part Number: CAY16-220J4LF; Value: 22R; Manufacturer: BOURNS; MPN: CAY16-220J4LF
R44 R46 R48 R56 R57 R60 R61 R79-R87 R107-R110 = R_0R_0402: SMT Resistor 0402; Manufacturer: MULTICOMP; MPN: MCMR04X000 PTL; Part Number: R_0R_0402; Value: 0R

## Sheet SoM-MGTH.SchDoc
size A3; DocumentNumber: 4; SheetNumber: 4; SheetTotal: 9; PageSetup: Record=PageOptions|CenterHorizontal=True|CenterVertical=True|PrintScale=0.97|XCorrection=1.00|YCorrection=1.00|PrintKind=1|BorderSize=5000000|LeftOffset=0|BottomOffset=0|Orientation=2|PaperLength=2970|PaperWidth=2100|Scale=100|PaperSource=7|PrintQuality=600|MediaType=1|DitherType=10|PaperKind=A4|PrintScaleMode=1
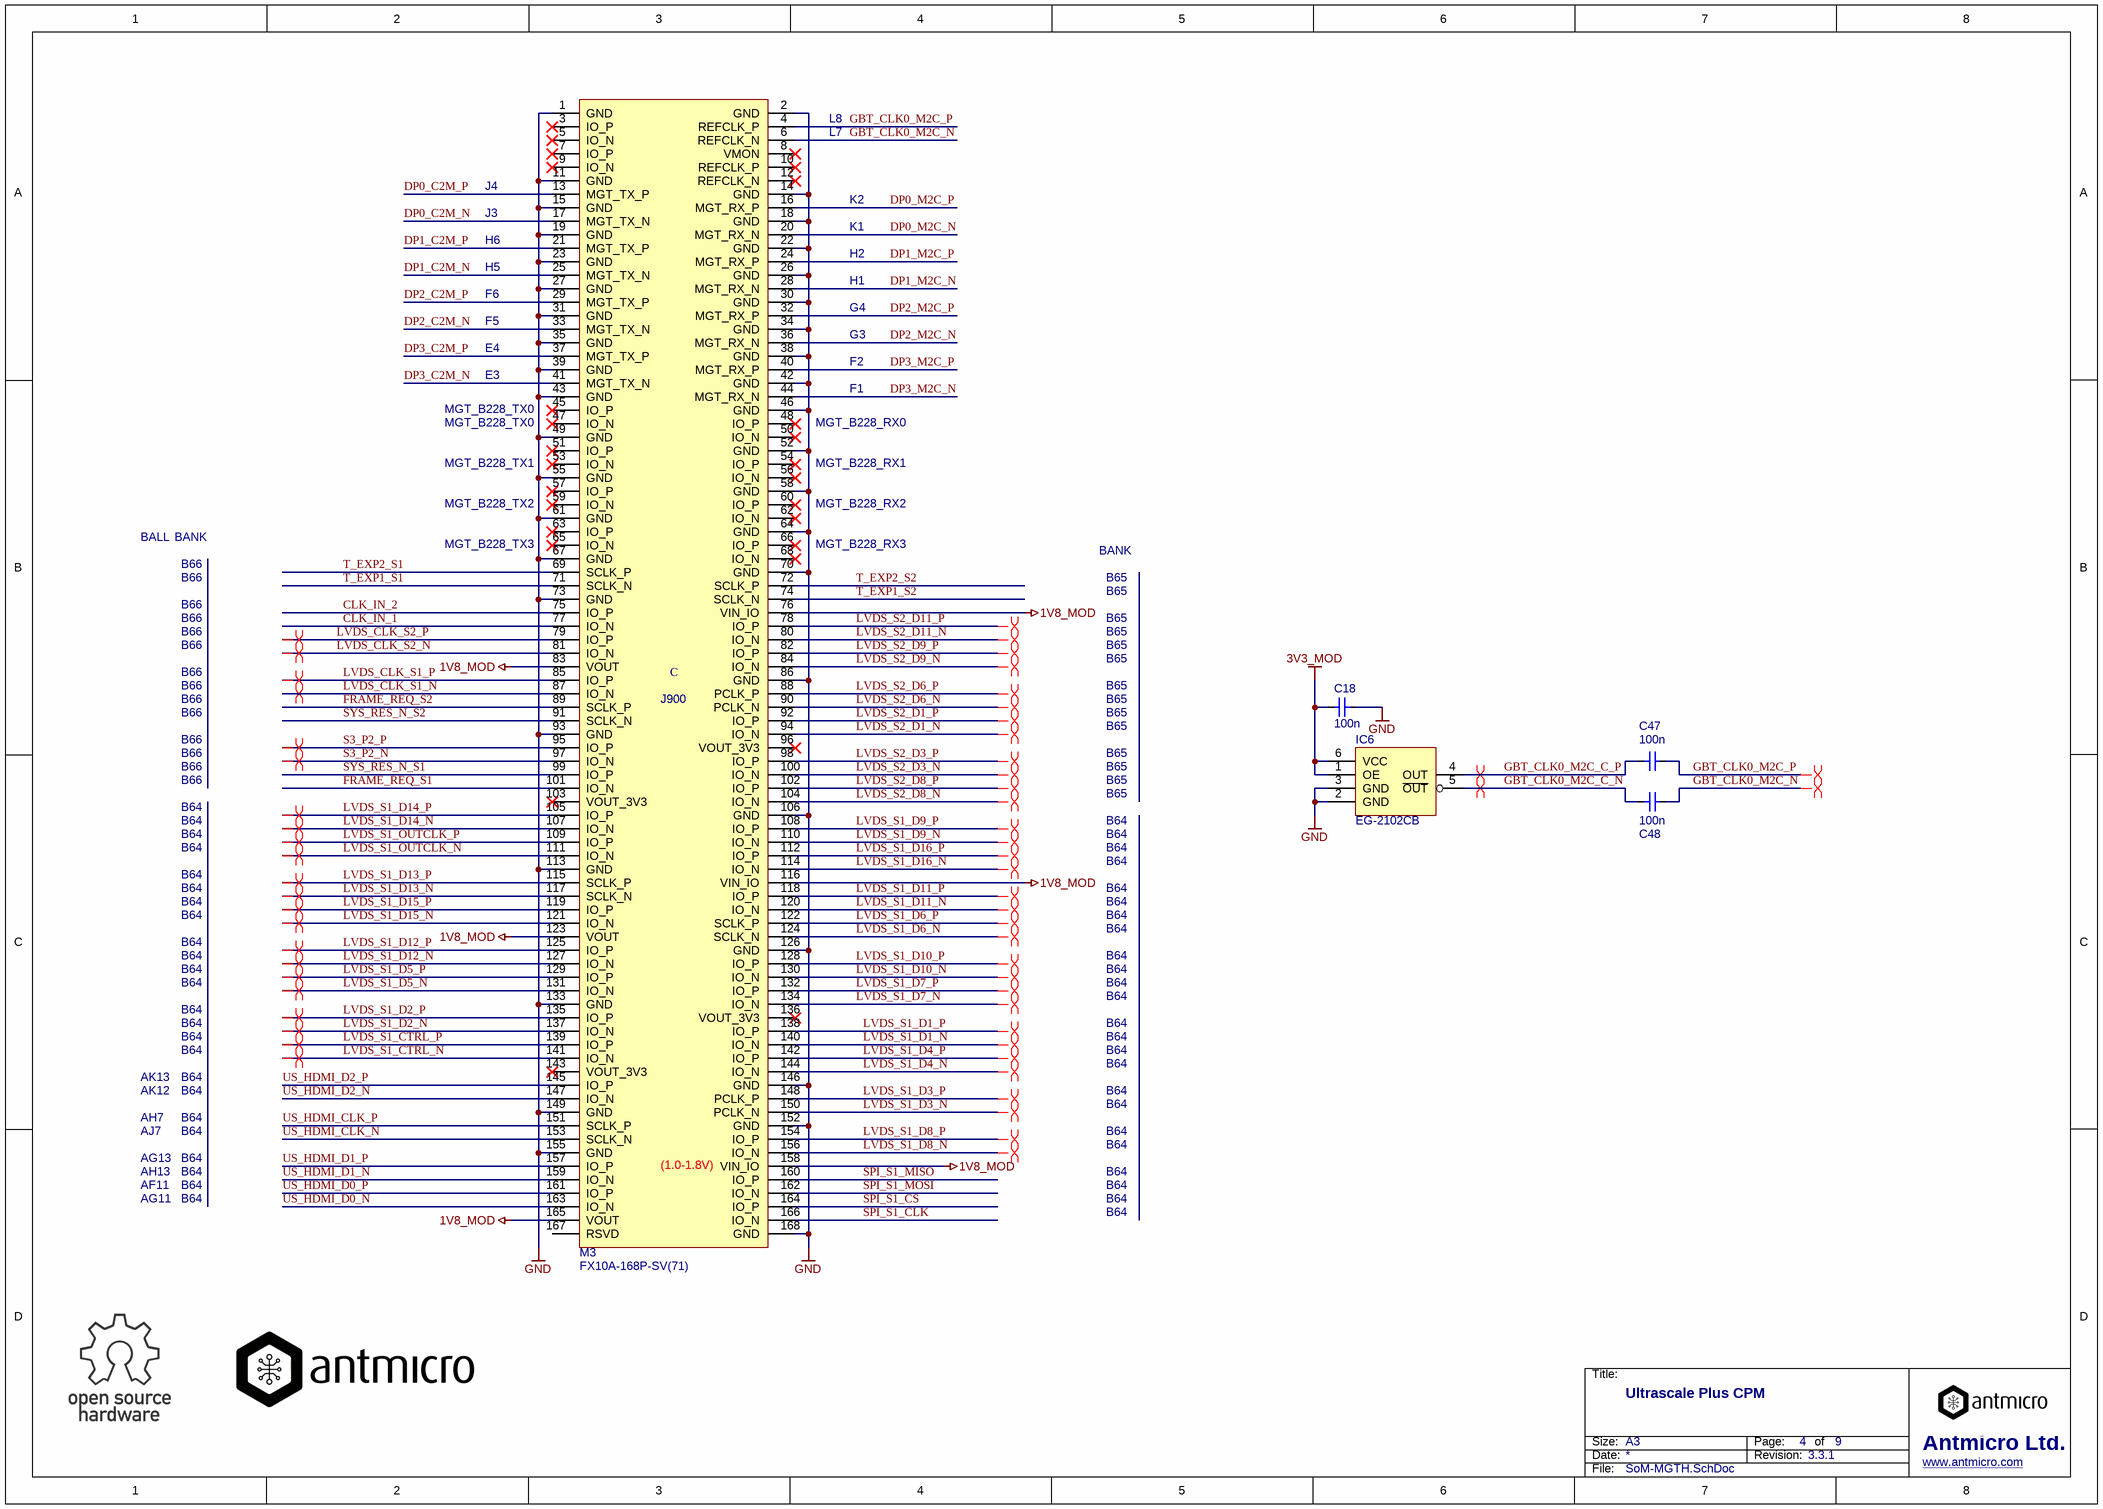
[diagram p3: SoM-MGTH.SchDoc]

### Parts
C18  100n  [0402]
C47  100n  [0402]
C48  100n  [0402]
IC6  EG-2102CB  [EG-2102CB]
M3  FX10A-168P-SV(71)  [HIROSE_FX10A-168P-SV(71)]

### Nets
1V8_MOD: M3.76(VIN_IO) M3.83(VOUT) M3.116(VIN_IO) M3.123(VOUT) M3.158(VIN_IO) M3.165(VOUT)
3V3_MOD: C18.2 IC6.1(OE) IC6.6(VCC)
GND: C18.1 IC6.2(GND) IC6.3(GND) M3.1(GND) M3.2(GND) M3.11(GND) M3.14(GND) M3.15(GND) M3.18(GND) M3.19(GND) M3.22(GND) M3.23(GND) M3.26(GND) M3.27(GND) M3.30(GND) M3.31(GND) M3.34(GND) M3.35(GND) M3.38(GND) M3.39(GND) M3.42(GND) M3.43(GND) M3.46(GND) M3.49(GND) M3.52(GND) M3.55(GND) M3.58(GND) M3.61(GND) M3.64(GND) M3.67(GND) M3.70(GND) M3.73(GND) M3.86(GND) M3.93(GND) M3.106(GND) M3.113(GND) M3.126(GND) M3.133(GND) M3.146(GND) M3.149(GND) M3.152(GND) M3.155(GND) M3.168(GND)
CLK_IN_1: M3.77(IO_N)
CLK_IN_2: M3.75(IO_P)
DP0_C2M_N: M3.17(MGT_TX_N)
DP0_C2M_P: M3.13(MGT_TX_P)
DP0_M2C_N: M3.20(MGT_RX_N)
DP0_M2C_P: M3.16(MGT_RX_P)
DP1_C2M_N: M3.25(MGT_TX_N)
DP1_C2M_P: M3.21(MGT_TX_P)
DP1_M2C_N: M3.28(MGT_RX_N)
DP1_M2C_P: M3.24(MGT_RX_P)
DP2_C2M_N: M3.33(MGT_TX_N)
DP2_C2M_P: M3.29(MGT_TX_P)
DP2_M2C_N: M3.36(MGT_RX_N)
DP2_M2C_P: M3.32(MGT_RX_P)
DP3_C2M_N: M3.41(MGT_TX_N)
DP3_C2M_P: M3.37(MGT_TX_P)
DP3_M2C_N: M3.44(MGT_RX_N)
DP3_M2C_P: M3.40(MGT_RX_P)
FRAME_REQ_S1: M3.101(IO_N)
FRAME_REQ_S2: M3.89(SCLK_P)
GBT_CLK0_M2C_C_N: C48.1 IC6.5(~{OUT})
GBT_CLK0_M2C_C_P: C47.1 IC6.4(OUT)
GBT_CLK0_M2C_N: C48.2 M3.6(REFCLK_N)
GBT_CLK0_M2C_P: C47.2 M3.4(REFCLK_P)
LVDS_CLK_S1_N: M3.87(IO_N)
LVDS_CLK_S1_P: M3.85(IO_P)
LVDS_CLK_S2_N: M3.81(IO_N)
LVDS_CLK_S2_P: M3.79(IO_P)
LVDS_S1_CTRL_N: M3.141(IO_N)
LVDS_S1_CTRL_P: M3.139(IO_P)
LVDS_S1_D1_N: M3.140(IO_N)
LVDS_S1_D1_P: M3.138(IO_P)
LVDS_S1_D2_N: M3.137(IO_N)
LVDS_S1_D2_P: M3.135(IO_P)
LVDS_S1_D3_N: M3.150(PCLK_N)
LVDS_S1_D3_P: M3.148(PCLK_P)
LVDS_S1_D4_N: M3.144(IO_N)
LVDS_S1_D4_P: M3.142(IO_P)
LVDS_S1_D5_N: M3.131(IO_N)
LVDS_S1_D5_P: M3.129(IO_P)
LVDS_S1_D6_N: M3.124(SCLK_N)
LVDS_S1_D6_P: M3.122(SCLK_P)
LVDS_S1_D7_N: M3.134(IO_N)
LVDS_S1_D7_P: M3.132(IO_P)
LVDS_S1_D8_N: M3.156(IO_N)
LVDS_S1_D8_P: M3.154(IO_P)
LVDS_S1_D9_N: M3.110(IO_N)
LVDS_S1_D9_P: M3.108(IO_P)
LVDS_S1_D10_N: M3.130(IO_N)
LVDS_S1_D10_P: M3.128(IO_P)
LVDS_S1_D11_N: M3.120(IO_N)
LVDS_S1_D11_P: M3.118(IO_P)
LVDS_S1_D12_N: M3.127(IO_N)
LVDS_S1_D12_P: M3.125(IO_P)
LVDS_S1_D13_N: M3.117(SCLK_N)
LVDS_S1_D13_P: M3.115(SCLK_P)
LVDS_S1_D14_N: M3.107(IO_N)
LVDS_S1_D14_P: M3.105(IO_P)
LVDS_S1_D15_N: M3.121(IO_N)
LVDS_S1_D15_P: M3.119(IO_P)
LVDS_S1_D16_N: M3.114(IO_N)
LVDS_S1_D16_P: M3.112(IO_P)
LVDS_S1_OUTCLK_N: M3.111(IO_N)
LVDS_S1_OUTCLK_P: M3.109(IO_P)
LVDS_S2_D1_N: M3.94(IO_N)
LVDS_S2_D1_P: M3.92(IO_P)
LVDS_S2_D3_N: M3.100(IO_N)
LVDS_S2_D3_P: M3.98(IO_P)
LVDS_S2_D6_N: M3.90(PCLK_N)
LVDS_S2_D6_P: M3.88(PCLK_P)
LVDS_S2_D8_N: M3.104(IO_N)
LVDS_S2_D8_P: M3.102(IO_P)
LVDS_S2_D9_N: M3.84(IO_N)
LVDS_S2_D9_P: M3.82(IO_P)
LVDS_S2_D11_N: M3.80(IO_N)
LVDS_S2_D11_P: M3.78(IO_P)
S3_P2_N: M3.97(IO_N)
S3_P2_P: M3.95(IO_P)
SPI_S1_CLK: M3.166(IO_N)
SPI_S1_CS: M3.164(IO_P)
SPI_S1_MISO: M3.160(IO_P)
SPI_S1_MOSI: M3.162(IO_N)
SYS_RES_N_S1: M3.99(IO_P)
SYS_RES_N_S2: M3.91(SCLK_N)
T_EXP1_S1: M3.71(SCLK_N)
T_EXP1_S2: M3.74(SCLK_N)
T_EXP2_S1: M3.69(SCLK_P)
T_EXP2_S2: M3.72(SCLK_P)
US_HDMI_CLK_N: M3.153(SCLK_N)
US_HDMI_CLK_P: M3.151(SCLK_P)
US_HDMI_D0_N: M3.163(IO_N)
US_HDMI_D0_P: M3.161(IO_P)
US_HDMI_D1_N: M3.159(IO_N)
US_HDMI_D1_P: M3.157(IO_P)
US_HDMI_D2_N: M3.147(IO_N)
US_HDMI_D2_P: M3.145(IO_P)

Not connected (* = marked no-connect by the designer): M3 3(IO_P)* 5(IO_N)* 7(IO_P)* 8(VMON)* 9(IO_N)* 10(REFCLK_P)* 12(REFCLK_N)* 45(IO_P)* 47(IO_N)* 48(IO_P)* 50(IO_N)* 51(IO_P)* 53(IO_N)* 54(IO_P)* 56(IO_N)* 57(IO_P)* 59(IO_N)* 60(IO_P)* 62(IO_N)* 63(IO_P)* 65(IO_N)* 66(IO_P)* 68(IO_N)* 96(VOUT_3V3)* 103(VOUT_3V3)* 136(VOUT_3V3)* 143(VOUT_3V3)* 167(RSVD)

### Layout directives
differential pair: GBT_CLK0_M2C_C_N, GBT_CLK0_M2C_C_P, GBT_CLK0_M2C_N, GBT_CLK0_M2C_P, LVDS_CLK_S1_N, LVDS_CLK_S1_P, LVDS_CLK_S2_N, LVDS_CLK_S2_P, LVDS_S1_CTRL_N, LVDS_S1_CTRL_P, LVDS_S1_D1_N, LVDS_S1_D1_P, LVDS_S1_D2_N, LVDS_S1_D2_P, LVDS_S1_D3_N, LVDS_S1_D3_P, LVDS_S1_D4_N, LVDS_S1_D4_P, LVDS_S1_D5_N, LVDS_S1_D5_P, LVDS_S1_D6_N, LVDS_S1_D6_P, LVDS_S1_D7_N, LVDS_S1_D7_P, LVDS_S1_D8_N, LVDS_S1_D8_P, LVDS_S1_D9_N, LVDS_S1_D9_P, LVDS_S1_D10_N, LVDS_S1_D10_P, LVDS_S1_D11_N, LVDS_S1_D11_P, LVDS_S1_D12_N, LVDS_S1_D12_P, LVDS_S1_D13_N, LVDS_S1_D13_P, LVDS_S1_D14_N, LVDS_S1_D14_P, LVDS_S1_D15_N, LVDS_S1_D15_P, LVDS_S1_D16_N, LVDS_S1_D16_P, LVDS_S1_OUTCLK_N, LVDS_S1_OUTCLK_P, LVDS_S2_D1_N, LVDS_S2_D1_P, LVDS_S2_D3_N, LVDS_S2_D3_P, LVDS_S2_D6_N, LVDS_S2_D6_P, LVDS_S2_D8_N, LVDS_S2_D8_P, LVDS_S2_D9_N, LVDS_S2_D9_P, LVDS_S2_D11_N, LVDS_S2_D11_P, S3_P2_N, S3_P2_P

### Notes on the sheet
- L8
- L7
- J3
- J4
- H6
- K2
- K1
- H5
- F6
- H2
- H1
- G4
- F5
- E3
- E4
- G3
- F2
- MGT_B228_TX0
- (near M3) MGT_B228_RX0
- F1
- MGT_B228_TX1
- MGT_B228_TX2
- (near M3) MGT_B228_RX1
- (near M3) MGT_B228_RX2
- BALL
- BANK
- B66
- MGT_B228_TX3
- (near M3) MGT_B228_RX3
- B65
- (near M3) J900
- B64
- AK13
- AK12
- AH7
- AJ7
- AG13
- AH13
- AF11
- (near M3) (1.0-1.8V)
- AG11
- Title:
- Size:
- Date:
- A3
- Revision:
- Page:
- of
- Antmicro Ltd.
- File:
- www.antmicro.com
- (in symbol Mercury_US1_C) C

### Library data of the parts
C18 C47 C48 = C_100n_0402: as C1 on sheet Backplane-Connector; Value: 100n; Part Number: C_100n_0402
IC6 = EG-2102CB: Standard Clock Oscillators 156.25MHz 3V3; Manufacturer: Epson; MPN: EG-2102CB 156.2500M-LGPAL3; Part Number: EG-2102CB; Value: EG-2102CB
M3 = Mercury_US1_C: Enclustra Mercury Ultrascale connector; Manufacturer: Hirose; Part Number: Mercury_US1_C; Value: FX10A-168P-SV(71); MPN: FX10A-168P-SV(71)

## Sheet Sensor-Connector.SchDoc
size A3; DocumentNumber: 5; SheetNumber: 5; SheetTotal: 9; PageSetup: Record=PageOptions|CenterHorizontal=True|CenterVertical=True|PrintScale=0.97|XCorrection=1.00|YCorrection=1.00|PrintKind=1|BorderSize=5000000|LeftOffset=0|BottomOffset=0|Orientation=2|PaperLength=2970|PaperWidth=2100|Scale=100|PaperSource=7|PrintQuality=600|MediaType=1|DitherType=10|PaperKind=A4|PrintScaleMode=1
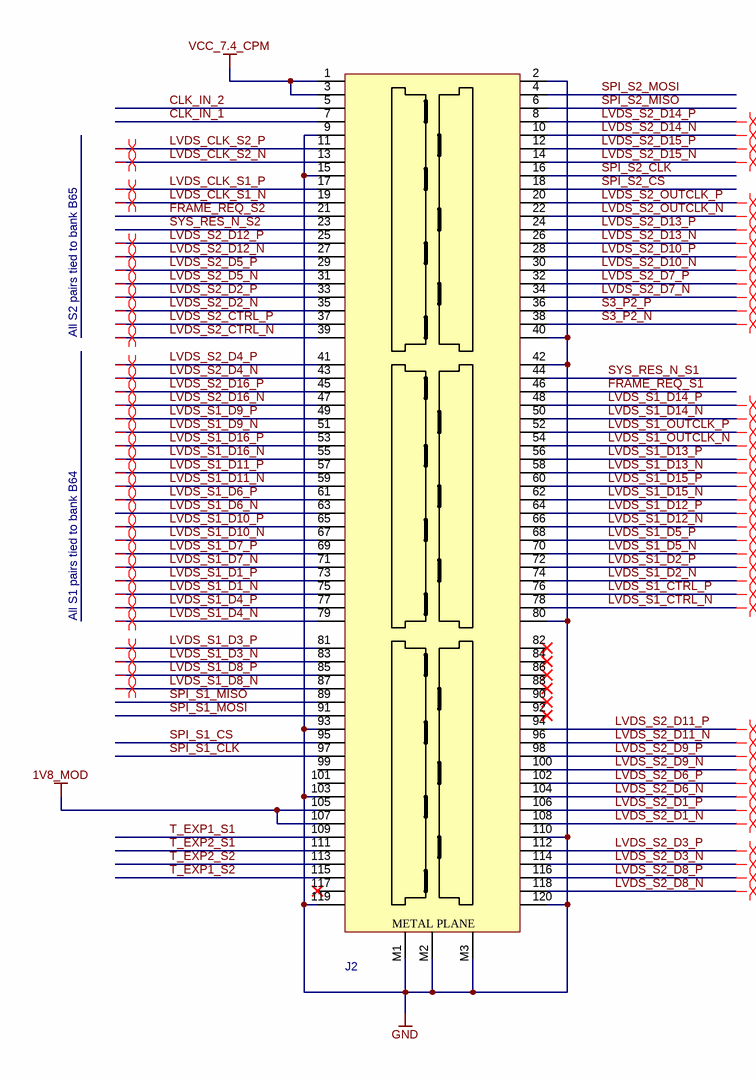
[diagram p4: Sensor-Connector.SchDoc]

### Parts
J2  QSE-060-01-L-D-A  [QSE-060-01-L-D-A]  (value not drawn)

### Nets
1V8_MOD: J2.105 J2.107
GND: J2.2 J2.9 J2.15 J2.40 J2.42 J2.80 J2.93 J2.103 J2.110 J2.119 J2.120 J2.M1 J2.M2 J2.M3
VCC_7.4_CPM: J2.1 J2.3
CLK_IN_1: J2.7
CLK_IN_2: J2.5
FRAME_REQ_S1: J2.46
FRAME_REQ_S2: J2.21
LVDS_CLK_S1_N: J2.19
LVDS_CLK_S1_P: J2.17
LVDS_CLK_S2_N: J2.13
LVDS_CLK_S2_P: J2.11
LVDS_S1_CTRL_N: J2.78
LVDS_S1_CTRL_P: J2.76
LVDS_S1_D1_N: J2.75
LVDS_S1_D1_P: J2.73
LVDS_S1_D2_N: J2.74
LVDS_S1_D2_P: J2.72
LVDS_S1_D3_N: J2.83
LVDS_S1_D3_P: J2.81
LVDS_S1_D4_N: J2.79
LVDS_S1_D4_P: J2.77
LVDS_S1_D5_N: J2.70
LVDS_S1_D5_P: J2.68
LVDS_S1_D6_N: J2.63
LVDS_S1_D6_P: J2.61
LVDS_S1_D7_N: J2.71
LVDS_S1_D7_P: J2.69
LVDS_S1_D8_N: J2.87
LVDS_S1_D8_P: J2.85
LVDS_S1_D9_N: J2.51
LVDS_S1_D9_P: J2.49
LVDS_S1_D10_N: J2.67
LVDS_S1_D10_P: J2.65
LVDS_S1_D11_N: J2.59
LVDS_S1_D11_P: J2.57
LVDS_S1_D12_N: J2.66
LVDS_S1_D12_P: J2.64
LVDS_S1_D13_N: J2.58
LVDS_S1_D13_P: J2.56
LVDS_S1_D14_N: J2.50
LVDS_S1_D14_P: J2.48
LVDS_S1_D15_N: J2.62
LVDS_S1_D15_P: J2.60
LVDS_S1_D16_N: J2.55
LVDS_S1_D16_P: J2.53
LVDS_S1_OUTCLK_N: J2.54
LVDS_S1_OUTCLK_P: J2.52
LVDS_S2_CTRL_N: J2.39
LVDS_S2_CTRL_P: J2.37
LVDS_S2_D1_N: J2.108
LVDS_S2_D1_P: J2.106
LVDS_S2_D2_N: J2.35
LVDS_S2_D2_P: J2.33
LVDS_S2_D3_N: J2.114
LVDS_S2_D3_P: J2.112
LVDS_S2_D4_N: J2.43
LVDS_S2_D4_P: J2.41
LVDS_S2_D5_N: J2.31
LVDS_S2_D5_P: J2.29
LVDS_S2_D6_N: J2.104
LVDS_S2_D6_P: J2.102
LVDS_S2_D7_N: J2.34
LVDS_S2_D7_P: J2.32
LVDS_S2_D8_N: J2.118
LVDS_S2_D8_P: J2.116
LVDS_S2_D9_N: J2.100
LVDS_S2_D9_P: J2.98
LVDS_S2_D10_N: J2.30
LVDS_S2_D10_P: J2.28
LVDS_S2_D11_N: J2.96
LVDS_S2_D11_P: J2.94
LVDS_S2_D12_N: J2.27
LVDS_S2_D12_P: J2.25
LVDS_S2_D13_N: J2.26
LVDS_S2_D13_P: J2.24
LVDS_S2_D14_N: J2.10
LVDS_S2_D14_P: J2.8
LVDS_S2_D15_N: J2.14
LVDS_S2_D15_P: J2.12
LVDS_S2_D16_N: J2.47
LVDS_S2_D16_P: J2.45
LVDS_S2_OUTCLK_N: J2.22
LVDS_S2_OUTCLK_P: J2.20
S3_P2_N: J2.38
S3_P2_P: J2.36
SPI_S1_CLK: J2.97
SPI_S1_CS: J2.95
SPI_S1_MISO: J2.89
SPI_S1_MOSI: J2.91
SPI_S2_CLK: J2.16
SPI_S2_CS: J2.18
SPI_S2_MISO: J2.6
SPI_S2_MOSI: J2.4
SYS_RES_N_S1: J2.44
SYS_RES_N_S2: J2.23
T_EXP1_S1: J2.109
T_EXP1_S2: J2.115
T_EXP2_S1: J2.111
T_EXP2_S2: J2.113

Not connected (* = marked no-connect by the designer): J2 82* 84* 86* 88* 90* 92* 99 101 117*

### Layout directives
differential pair: LVDS_CLK_S1_N, LVDS_CLK_S1_P, LVDS_CLK_S2_N, LVDS_CLK_S2_P, LVDS_S1_CTRL_N, LVDS_S1_CTRL_P, LVDS_S1_D1_N, LVDS_S1_D1_P, LVDS_S1_D2_N, LVDS_S1_D2_P, LVDS_S1_D3_N, LVDS_S1_D3_P, LVDS_S1_D4_N, LVDS_S1_D4_P, LVDS_S1_D5_N, LVDS_S1_D5_P, LVDS_S1_D6_N, LVDS_S1_D6_P, LVDS_S1_D7_N, LVDS_S1_D7_P, LVDS_S1_D8_N, LVDS_S1_D8_P, LVDS_S1_D9_N, LVDS_S1_D9_P, LVDS_S1_D10_N, LVDS_S1_D10_P, LVDS_S1_D11_N, LVDS_S1_D11_P, LVDS_S1_D12_N, LVDS_S1_D12_P, LVDS_S1_D13_N, LVDS_S1_D13_P, LVDS_S1_D14_N, LVDS_S1_D14_P, LVDS_S1_D15_N, LVDS_S1_D15_P, LVDS_S1_D16_N, LVDS_S1_D16_P, LVDS_S1_OUTCLK_N, LVDS_S1_OUTCLK_P, LVDS_S2_CTRL_N, LVDS_S2_CTRL_P, LVDS_S2_D1_N, LVDS_S2_D1_P, LVDS_S2_D2_N, LVDS_S2_D2_P, LVDS_S2_D3_N, LVDS_S2_D3_P, LVDS_S2_D4_N, LVDS_S2_D4_P, LVDS_S2_D5_N, LVDS_S2_D5_P, LVDS_S2_D6_N, LVDS_S2_D6_P, LVDS_S2_D7_N, LVDS_S2_D7_P, LVDS_S2_D8_N, LVDS_S2_D8_P, LVDS_S2_D9_N, LVDS_S2_D9_P, LVDS_S2_D10_N, LVDS_S2_D10_P, LVDS_S2_D11_N, LVDS_S2_D11_P, LVDS_S2_D12_N, LVDS_S2_D12_P, LVDS_S2_D13_N, LVDS_S2_D13_P, LVDS_S2_D14_N, LVDS_S2_D14_P, LVDS_S2_D15_N, LVDS_S2_D15_P, LVDS_S2_D16_N, LVDS_S2_D16_P, LVDS_S2_OUTCLK_N, LVDS_S2_OUTCLK_P, S3_P2_N, S3_P2_P

### Notes on the sheet
- All S2 pairs tied to bank B65
- All S1 pairs tied to bank B64
- Title:
- Size:
- Date:
- A3
- Revision:
- Page:
- of
- Antmicro Ltd.
- File:
- www.antmicro.com
- (in symbol QSE-060-01-L-D-A) METAL PLANE

### Library data of the parts
J2 = QSE-060-01-L-D-A: SAMTEC 	QSE-60-01-L-D-A  Stacking Board Connector, Dual Row, QSE Series, Receptacle, 0.8 m, 120 Contacts, Surface Mount; Value: QSE-060-01-L-D-A; Manufacturer: SAMTEC; MPN: QSE-060-01-L-D-A

## Sheet Display-Port.SchDoc
size A3; DocumentNumber: 6; SheetNumber: 6; SheetTotal: 9; PageSetup: Record=PageOptions|CenterHorizontal=True|CenterVertical=True|PrintScale=0.97|XCorrection=1.00|YCorrection=1.00|PrintKind=1|BorderSize=5000000|LeftOffset=0|BottomOffset=0|Orientation=2|PaperLength=2970|PaperWidth=2100|Scale=100|PaperSource=7|PrintQuality=600|MediaType=1|DitherType=10|PaperKind=A4|PrintScaleMode=1
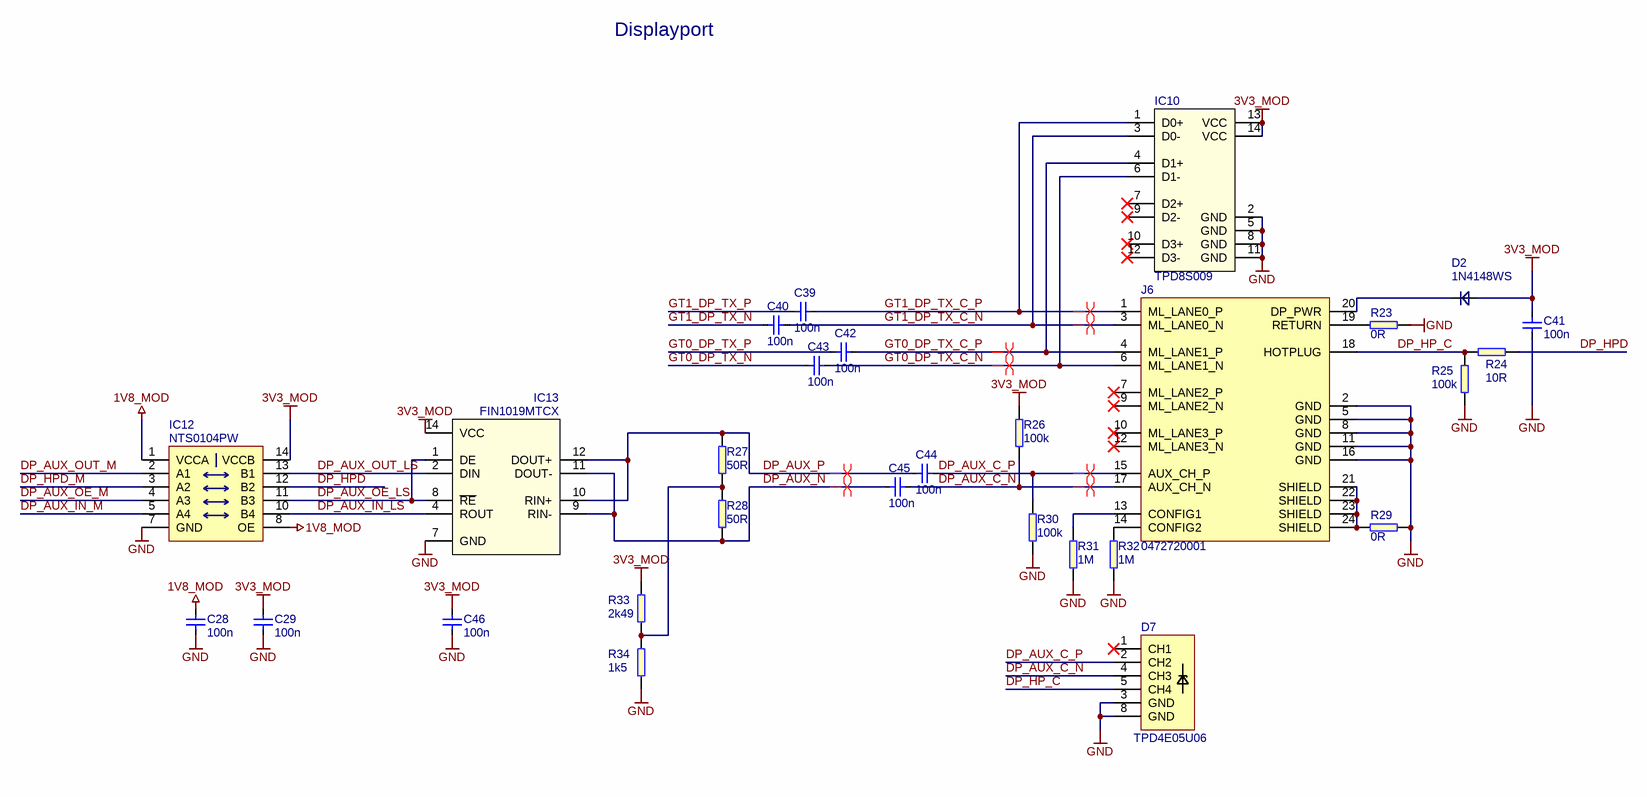
[diagram p5: Display-Port.SchDoc]

### Parts
C28  100n  [0603]
C29  100n  [0603]
C39  100n  [0603]
C40  100n  [0603]
C41  100n  [0603]
C42  100n  [0603]
C43  100n  [0603]
C44  100n  [0603]
C45  100n  [0603]
C46  100n  [0603]
D2  1N4148WS  [SOD-323]
D7  TPD4E05U06  [TPD4E05U06_PASS]
IC10  TPD8S009  [SON-15]
IC12  NTS0104PW  [TSSOP-14]
IC13  FIN1019MTCX  [TSSOP-14]
J6  0472720001
R23  0R  [0603]
R24  10R  [0603]
R25  100k  [0603]
R26  100k  [0603]
R27  50R  [0603]
R28  50R  [0603]
R29  0R  [0603]
R30  100k  [0603]
R31  1M  [0603]
R32  1M  [0603]
R33  2k49  [0603]
R34  1k5  [0603]

### Nets
1V8_MOD: C28.2 IC12.1(VCCA) IC12.8(OE)
3V3_MOD: C29.2 C41.1 C46.2 D2.A IC10.13(VCC) IC10.14(VCC) IC12.14(VCCB) IC13.14(VCC) R26.2 R33.2
GND: C28.1 C29.1 C41.2 C46.1 D7.3(GND) D7.8(GND) IC10.2(GND) IC10.5(GND) IC10.8(GND) IC10.11(GND) IC12.7(GND) IC13.7(GND) J6.2(GND) J6.5(GND) J6.8(GND) J6.11(GND) J6.16(GND) R23.2 R25.1 R29.2 R30.1 R31.1 R32.1 R34.1
DP_AUX_C_N: C45.2 D7.4(CH3) J6.17(AUX_CH_N) R26.1
DP_AUX_C_P: C44.2 D7.2(CH2) J6.15(AUX_CH_P) R30.2
DP_AUX_IN_LS: IC12.10(B4) IC13.4(ROUT)
DP_AUX_IN_M: IC12.5(A4)
DP_AUX_N: C45.1 IC13.9(RIN-) IC13.11(DOUT-) R28.1
DP_AUX_OE_LS: IC12.11(B3) IC13.1(DE) IC13.8(~{RE})
DP_AUX_OE_M: IC12.4(A3)
DP_AUX_OUT_LS: IC12.13(B1) IC13.2(DIN)
DP_AUX_OUT_M: IC12.2(A1)
DP_AUX_P: C44.1 IC13.10(RIN+) IC13.12(DOUT+) R27.2
DP_HP_C: D7.5(CH4) J6.18(HOTPLUG) R24.1 R25.2
DP_HPD: IC12.12(B2) R24.2
DP_HPD_M: IC12.3(A2)
GT0_DP_TX_C_N: C43.2 IC10.6(D1-) J6.6(ML_LANE1_N)
GT0_DP_TX_C_P: C42.2 IC10.4(D1+) J6.4(ML_LANE1_P)
GT0_DP_TX_N: C43.1
GT0_DP_TX_P: C42.1
GT1_DP_TX_C_N: C40.2 IC10.3(D0-) J6.3(ML_LANE0_N)
GT1_DP_TX_C_P: C39.2 IC10.1(D0+) J6.1(ML_LANE0_P)
GT1_DP_TX_N: C40.1
GT1_DP_TX_P: C39.1
NetD2_C: D2.C J6.20(DP_PWR)
NetJ6_13: J6.13(CONFIG1) R31.2
NetJ6_14: J6.14(CONFIG2) R32.2
NetJ6_19: J6.19(RETURN) R23.1
NetJ6_21: J6.21(SHIELD) J6.22(SHIELD) J6.23(SHIELD) J6.24(SHIELD) R29.1
NetR27_1: R27.1 R28.2 R33.1 R34.2

Not connected (* = marked no-connect by the designer): D7 1(CH1)*; IC10 7(D2+)* 9(D2-)* 10(D3+)* 12(D3-)*; J6 7(ML_LANE2_P)* 9(ML_LANE2_N)* 10(ML_LANE3_P)* 12(ML_LANE3_N)*

### Layout directives
differential pair: DP_AUX_C_N, DP_AUX_C_P, DP_AUX_N, DP_AUX_P, GT0_DP_TX_C_N, GT0_DP_TX_C_P, GT1_DP_TX_C_N, GT1_DP_TX_C_P

### Notes on the sheet
- Displayport
- Title:
- Size:
- Date:
- A3
- Revision:
- Page:
- of
- Antmicro Ltd.
- File:
- www.antmicro.com

### Library data of the parts
C28 C29 C39-C46 = C_100n_0603: MLCC SMT Capacitor 100nF 0603; Manufacturer: WALSIN; MPN: 0603B104K500CT; Value: 100n; Part Number: C_100n_0603
D2 = 1N4148WS: Diode small signal; Manufacturer: MULTICOMP; Part Number: 1N4148WS; Value: 1N4148WS; MPN: 1N4148WS
D7 = TPD4E05U06_PASS: ESD Suppressors 4-CH; Manufacturer: Texas Instruments; MPN: TPD4E05U06DQAR; Part Number: TPD4E05U06_PASS; Value: TPD4E05U06
IC10 = TPD8S009: 8-Channel ESD Protection for DisplayPort and HDMI; Manufacturer: TEXAS INSTRUMENTS; MPN: TPD8S009DSMR; Part Number: TPD8S009; Value: TPD8S009
IC12 = NTS0104PW: as IC1 on sheet Backplane-Connector; Part Number: NTS0104PW; Value: NTS0104PW; MPN: NTS0104PW
IC13 = FIN1019MTCX: 3.3 V LVDS High Speed Differential Driver Receiver; Manufacturer: OM SEMICONDUCTOR; Part Number: FIN1019MTCX; Value: FIN1019MTCX; MPN: FIN1019MTCX
J6 = CON-Molex-047272-0001: Manufacturer: Molex; Value: 0472720001; MPN: 0472720001
R23 R29 = R_0R_0603: as R59 on sheet Supplies; Value: 0R; Part Number: R_0R_0603
R24 = R_10R_0603: SMT Resistor 10R 0603; Manufacturer: MULTICOMP; MPN: MCWR06X10R0FTL; Value: 10R; Part Number: R_10R_0603
R25 = R_100k_0603: as R37 on sheet Supplies; Value: 100k; Part Number: R_100k_0603
R26 R30 = R_100k_0603_1%: SMT Resistor 100k 0603 1%; Manufacturer: BOURNS; MPN: CR0603-FX-1003HLF; Value: 100k; Part Number: R_100k_0603_1%
R27 R28 = R_50R_0603_1%: SMT Resistor 50R 0603 1%; Manufacturer: VISHAY; MPN: CRCW060350R0FKEA; Value: 50R; Part Number: R_50R_0603_1%
R31 R32 = R_1M_0603: SMT Resistor 1M 0603; Manufacturer: BOURNS; MPN: CR0603-JW-105GLF; Value: 1M; Part Number: R_1M_0603
R33 = R_2k49_0603_1%: SMT Resistor 2k49 0603 1%; Manufacturer: Vishay; MPN: CRCW06032K49FKEA; Value: 2k49; Part Number: R_2k49_0603_1%
R34 = R_1k5_0603: SMT Resistor 1k5 0603; Manufacturer: TE CONNECTIVITY / NEOHM; MPN: CPF0603B1K5E1; Value: 1k5; Part Number: R_1k5_0603

## Sheet Debug.SchDoc
size A3; DocumentNumber: 7; SheetNumber: 7; SheetTotal: 9; PageSetup: Record=PageOptions|CenterHorizontal=True|CenterVertical=True|PrintScale=0.97|XCorrection=1.00|YCorrection=1.00|PrintKind=1|BorderSize=5000000|LeftOffset=0|BottomOffset=0|Orientation=2|PaperLength=2970|PaperWidth=2100|Scale=100|PaperSource=7|PrintQuality=600|MediaType=1|DitherType=10|PaperKind=A4|PrintScaleMode=1
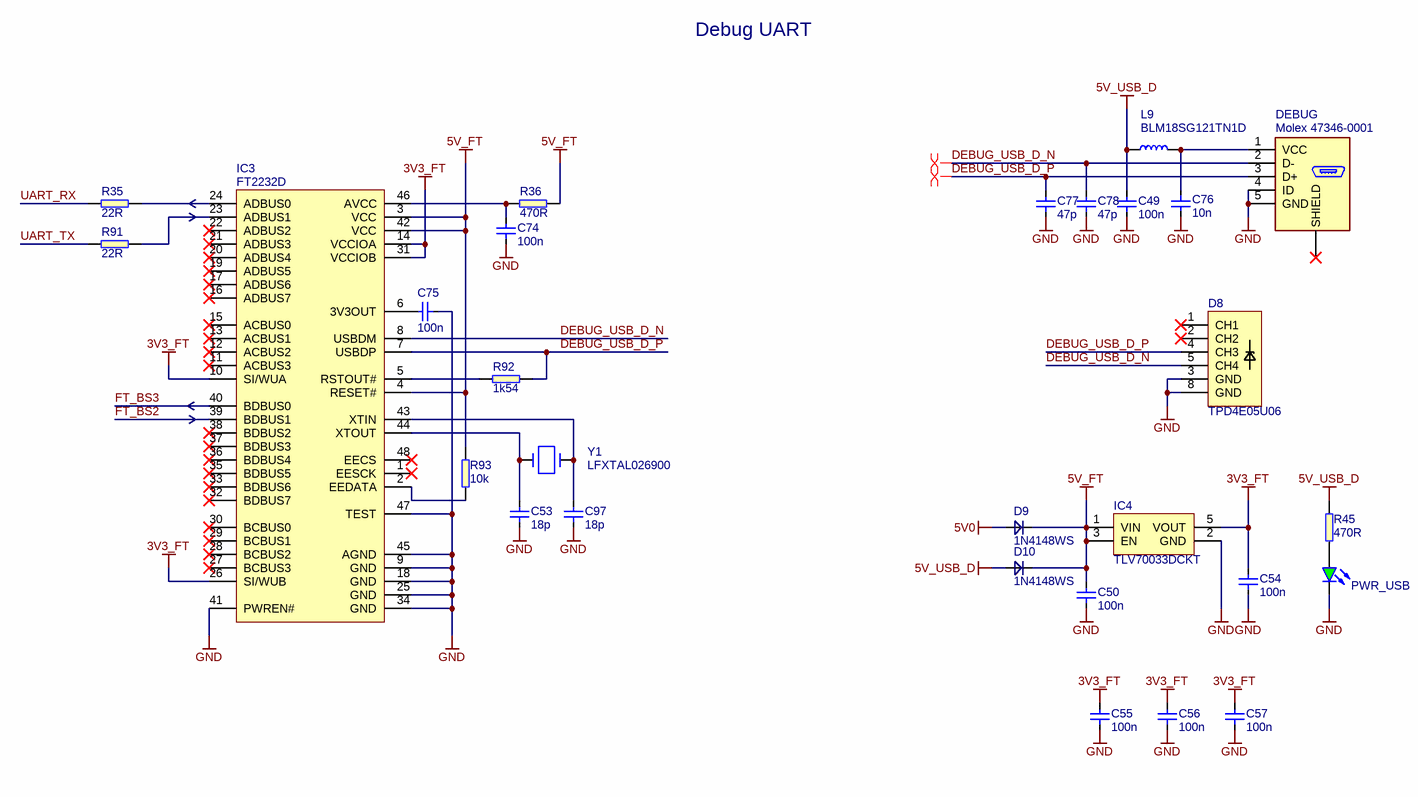
[diagram p6: Debug.SchDoc]

### Parts
C49  100n  [0603]
C50  100n  [0402]
C53  18p  [0402]
C54  100n  [0402]
C55  100n  [0402]
C56  100n  [0402]
C57  100n  [0402]
C74  100n  [0402]
C75  100n  [0402]
C76  10n  [0603]
C77  47p  [0402]
C78  47p  [0402]
C97  18p  [0402]
D8  TPD4E05U06  [TPD4E05U06_PASS]
D9  1N4148WS  [SOD-323]
D10  1N4148WS  [SOD-323]
DEBUG  Molex 47346-0001  [CON-Molex-047346-0001]
IC3  FT2232D  [LQFP-48]
IC4  TLV70033DCKT  [SC70-5]
L9  BLM18SG121TN1D  [0603]
PWR_USB  KPT-1608SGC  [LED0603]  (value not drawn)
R35  22R  [0402]
R36  470R  [0402]
R45  470R  [0603]
R91  22R  [0402]
R92  1k54  [0402]
R93  10k  [0402]
Y1  LFXTAL026900  [crystal_smd]

### Nets
3V3_FT: C54.2 C55.2 C56.2 C57.2 IC3.10(SI/WUA) IC3.14(VCCIOA) IC3.26(SI/WUB) IC3.31(VCCIOB) IC4.5(VOUT)
5V0: D9.A
5V_FT: C50.2 D9.C D10.C IC3.3(VCC) IC3.4(RESET#) IC3.42(VCC) IC4.1(VIN) IC4.3(EN) R36.1 R93.2
5V_USB_D: C49.2 D10.A L9.1 R45.2
GND: C49.1 C50.1 C53.1 C54.1 C55.1 C56.1 C57.1 C74.1 C75.1 C76.2 C77.1 C78.1 C97.1 D8.3(GND) D8.8(GND) DEBUG.4(ID) DEBUG.5(GND) IC3.9(GND) IC3.18(GND) IC3.25(GND) IC3.34(GND) IC3.41(PWREN#) IC3.45(AGND) IC3.47(TEST) IC4.2(GND) PWR_USB.K
DEBUG_USB_D_N: C78.2 D8.5(CH4) DEBUG.2(D-) IC3.8(USBDM)
DEBUG_USB_D_P: C77.2 D8.4(CH3) DEBUG.3(D+) IC3.7(USBDP) R92.1
FT_BS2: IC3.39(BDBUS1)
FT_BS3: IC3.40(BDBUS0)
UART_RX: R35.1
UART_TX: R91.1
NetC53_2: C53.2 IC3.44(XTOUT) Y1.2
NetC74_2: C74.2 IC3.46(AVCC) R36.2
NetC75_2: C75.2 IC3.6(3V3OUT)
NetC76_1: C76.1 DEBUG.1(VCC) L9.2
NetC97_2: C97.2 IC3.43(XTIN) Y1.1
NetIC3_2: IC3.2(EEDATA) R93.1
NetIC3_5: IC3.5(RSTOUT#) R92.2
NetIC3_23: IC3.23(ADBUS1) R91.2
NetIC3_24: IC3.24(ADBUS0) R35.2
NetPWR_USB_A: PWR_USB.A R45.1

Not connected (* = marked no-connect by the designer): D8 1(CH1)* 2(CH2)*; DEBUG S(SHIELD)*; IC3 1(EESCK)* 11(ACBUS3)* 12(ACBUS2)* 13(ACBUS1)* 15(ACBUS0)* 16(ADBUS7)* 17(ADBUS6)* 19(ADBUS5)* 20(ADBUS4)* 21(ADBUS3)* 22(ADBUS2)* 27(BCBUS3)* 28(BCBUS2)* 29(BCBUS1)* 30(BCBUS0)* 32(BDBUS7)* 33(BDBUS6)* 35(BDBUS5)* 36(BDBUS4)* 37(BDBUS3)* 38(BDBUS2)* 48(EECS)*

### Layout directives
differential pair: DEBUG_USB_D_N, DEBUG_USB_D_P

### Notes on the sheet
- Debug UART
- Title:
- Size:
- Date:
- A3
- Revision:
- Page:
- of
- Antmicro Ltd.
- File:
- www.antmicro.com

### Library data of the parts
C49 = C_100n_0603: as C28 on sheet Display-Port; Value: 100n; Part Number: C_100n_0603
C50 C54-C57 C74 C75 = C_100n_0402: as C1 on sheet Backplane-Connector; Value: 100n; Part Number: C_100n_0402
C53 C97 = C_18p_0402: MLCC SMT Capacitor 18pF 0603; Manufacturer: KEMET; MPN: C0402C180J5GACAUTO; Value: 18p; Part Number: C_18p_0402
C76 = C_10n_0603: MLCC SMT Capacitor 10nF 0603; Manufacturer: AVX; MPN: 06031C103JAT2A; Value: 10n; Part Number: C_10n_0603
C77 C78 = C_47p_0402: MLCC SMT Capacitor 47pF 0402; Manufacturer: KEMET; MPN: C0402C470J5GACTU; Value: 47p; Part Number: C_47p_0402
D8 = TPD4E05U06_PASS: as D7 on sheet Display-Port; Part Number: TPD4E05U06_PASS; Value: TPD4E05U06
D9 D10 = 1N4148WS: as D2 on sheet Display-Port; Part Number: 1N4148WS; Value: 1N4148WS; MPN: 1N4148WS
DEBUG = CON-Molex-47346-0001: USB - micro B Receptacle Connector 5 Position Surface Mount, Right Angle, Horizontal; MPN: 473460001; Part Number: CON-Molex-47346-0001; Value: Molex 47346-0001; Manufacturer: Molex
IC3 = FT2232D: Dual USB-UART/FIFO; Manufacturer: FTDI; MPN: FT2232D-REEL; Part Number: FT2232D; Value: FT2232D
IC4 = TLV70033DCKT: Voltage Regulator, 2V to 5.5V, 175mV Dropout, 3.3Vout, 200mAout; Manufacturer: TEXAS INSTRUMENTS; Part Number: TLV70033DCKT; Value: TLV70033DCKT; MPN: TLV70033DCKT
L9 = BLM18SG121TN1D: FERRITE BEAD, 0.025OHM, 3A, 0603; Manufacturer: MURATA; Part Number: BLM18SG121TN1D; Value: BLM18SG121TN1D; MPN: BLM18SG121TN1D
PWR_USB = LED_G: as LED3 on sheet Supplies; Value: KPT-1608SGC; MPN: KPT-1608SGC
R35 R91 = R_22R_0402: SMT Resistor 22R 0402; Manufacturer: VISHAY; MPN: CRCW040222R0FKED; Value: 22R; Part Number: R_22R_0402
R36 = R_470R_0402: SMT Resistor 470R 0402; Manufacturer: VISHAY; MPN: CRCW0402470RFKED.; Value: 470R; Part Number: R_470R_0402
R45 = R_470R_0603: as R3 on sheet Supplies; Value: 470R; Part Number: R_470R_0603
R92 = R_1k54_0402: SMT Resistor 1k54 0402; Manufacturer: VISHAY; MPN: CRCW04021K54FKED.; Value: 1k54; Part Number: R_1k54_0402
R93 = R_10k_0402: SMT Resistor 0402; Manufacturer: MULTICOMP; MPN: MCMR04X1002FTL; Value: 10k; Part Number: R_10k_0402
Y1 = CRYSTAL_6MHz_SMD: CRYSTAL, 6MHZ, 18PF, SMD; Manufacturer: IQD FREQUENCY PRODUCTS; Value: LFXTAL026900; Part Number: CRYSTAL_6MHz_SMD; MPN: LFXTAL026900